# EAGLE design standalone (EAGLE 6.3)
AUTHOR: Ashley Grealish; VERSION: 0.1
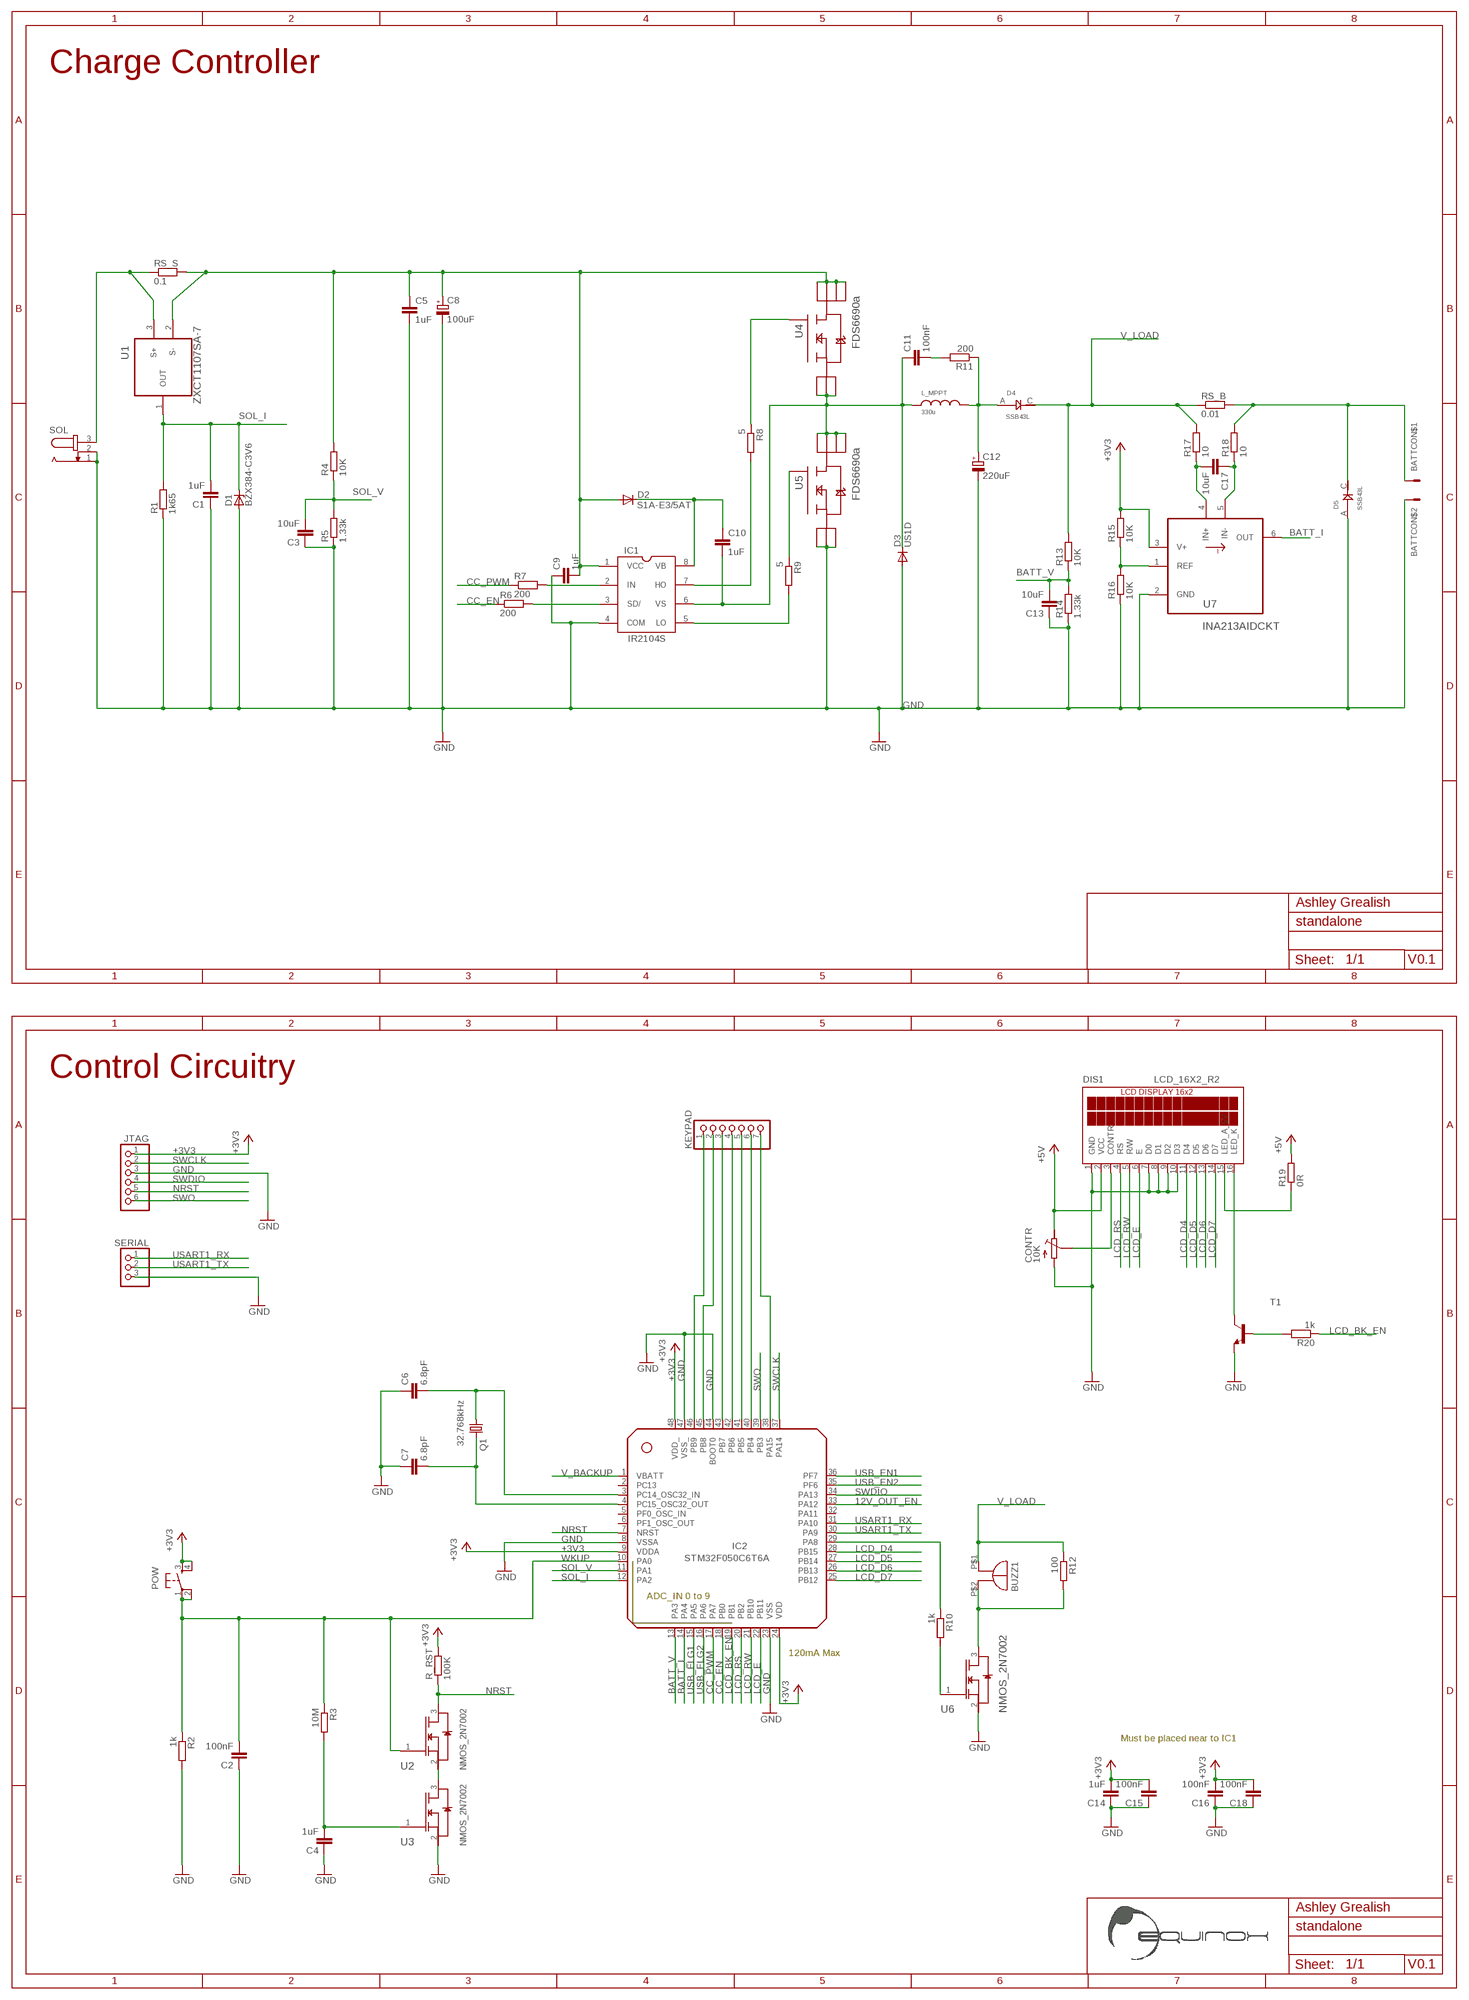
[diagram p0: schematic, sheet 1, part 1 of 2]
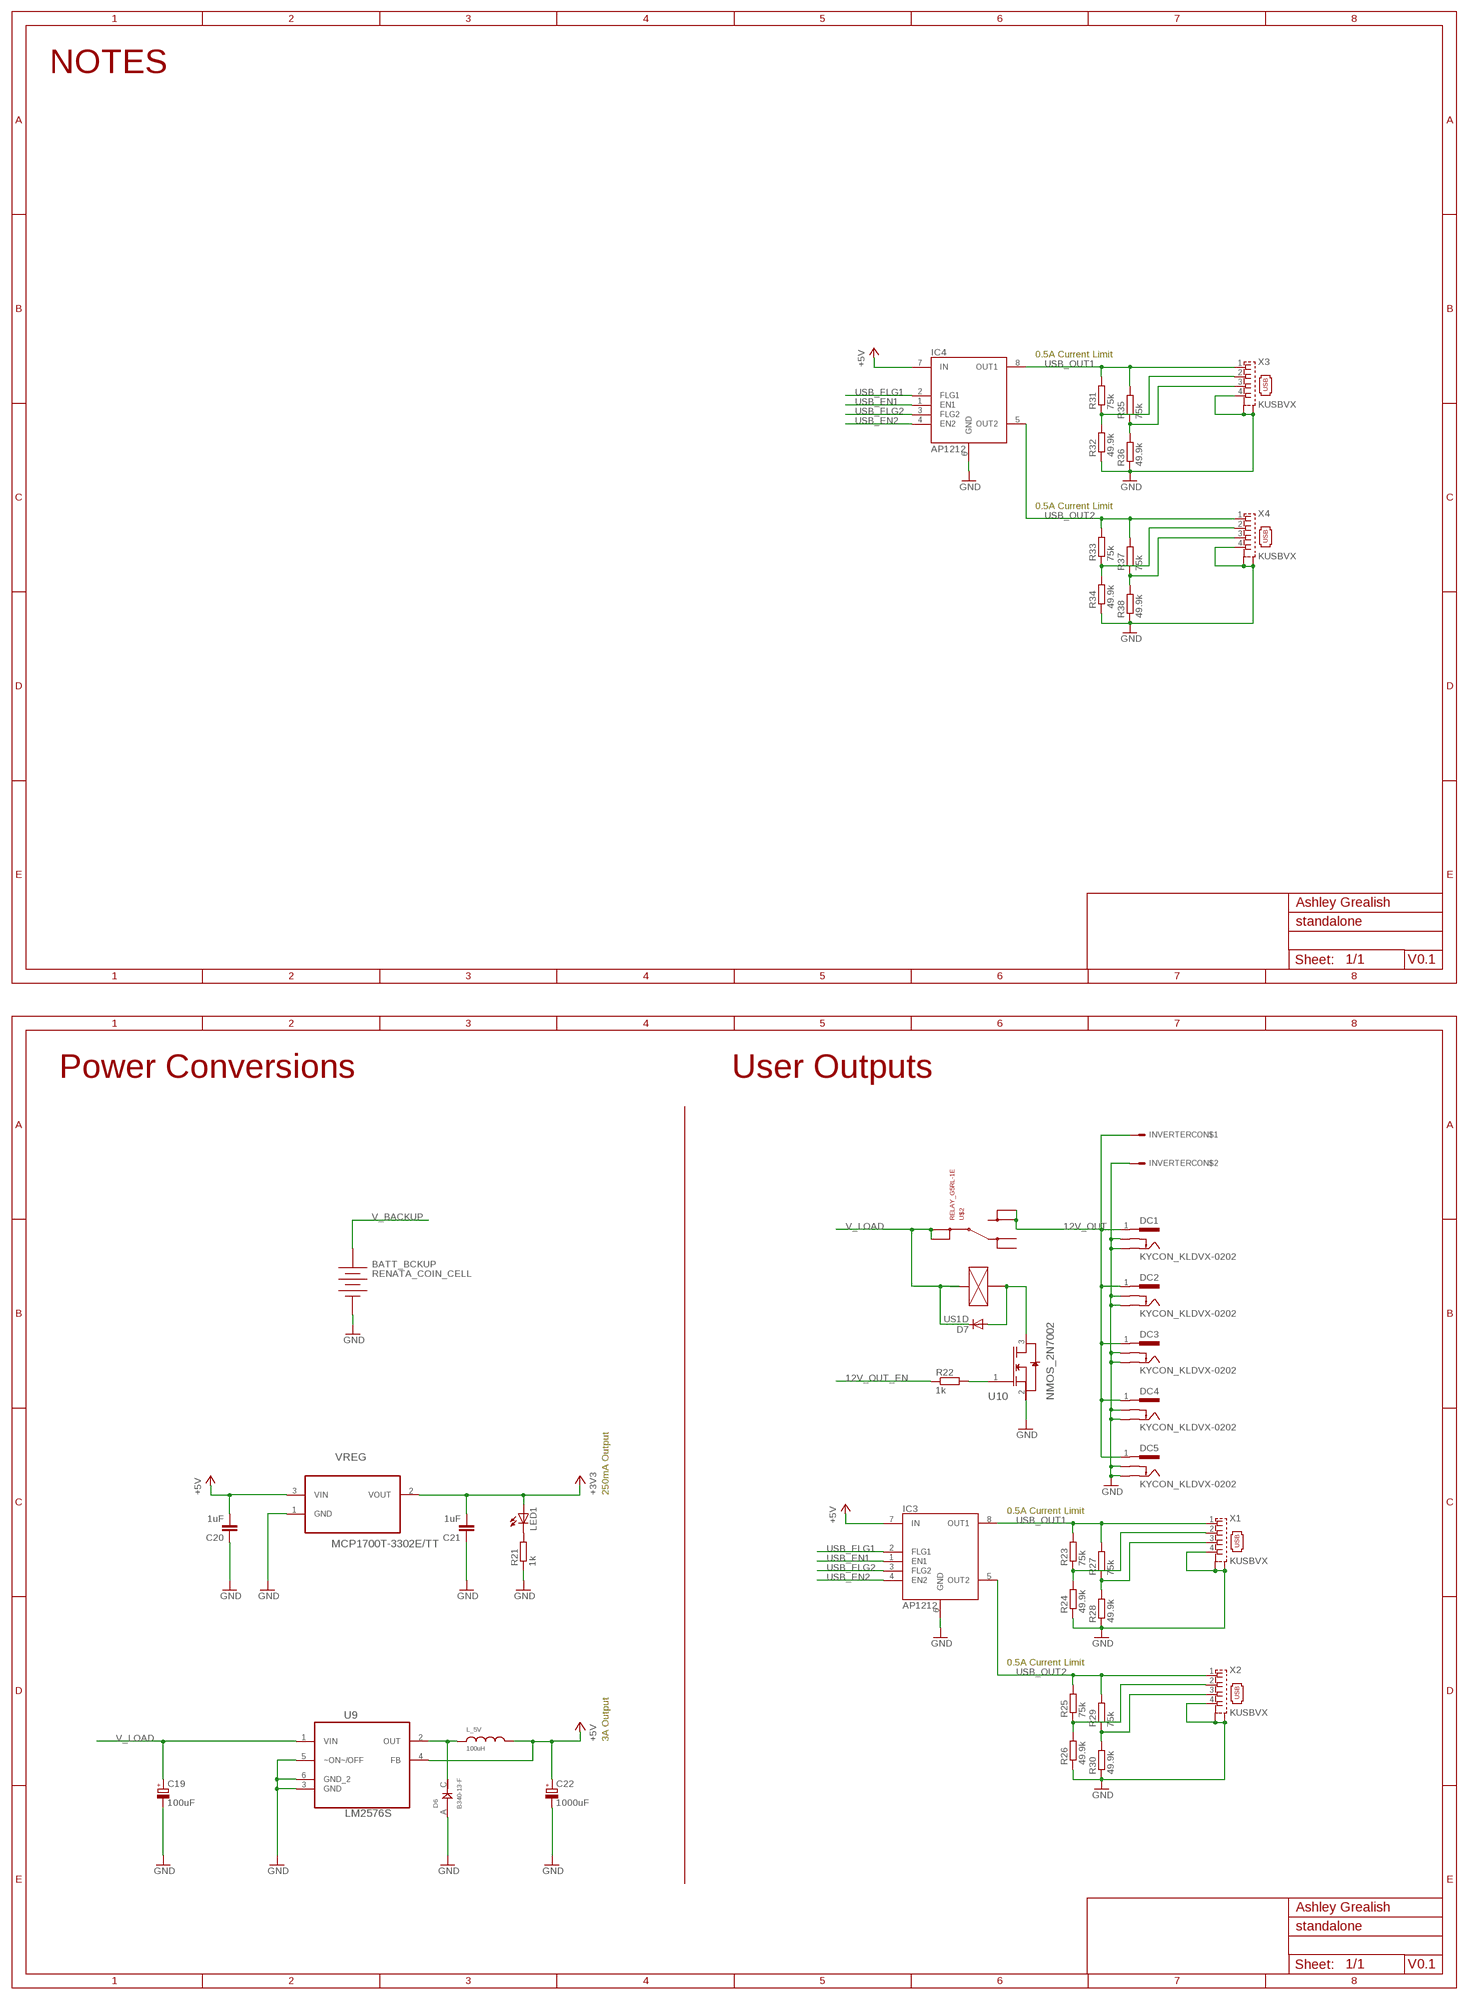
[diagram p1: schematic, sheet 1, part 2 of 2]

## Parts
BATT  CON_MOLEX_39_29_1028  [MOLEX_39_29_1028]
BATT_BCKUP  RENATA_COIN_CELL  PANASONIC_CR2032_1298246  [PANASONIC_CR2032_1298246]
BUZZ1  BUZZ_14MM  [BUZZ_14MM_5M_PINS]
C1  1uF  C-EUC0805K  [C0805K]
C2  100nF  C-EUC0805K  [C0805K]
C3  10uF  C-EUC0805K  [C0805K]
C4  1uF  C-EUC0805K  [C0805K]
C5  1uF  C-EUC0805K  [C0805K]
C6  6.8pF  C-EUC0603K  [C0603K]
C7  6.8pF  C-EUC0603K  [C0603K]
C8  100uF  CPOL-EUE  [PANASONIC_E]
C9  1uF  C-EUC0805K  [C0805K]
C10  1uF  C-EUC0805K  [C0805K]
C11  100nF  C-EUC0805K  [C0805K]
C12  220uF  CPOL-EUF  [PANASONIC_F]
C13  10uF  C-EUC0805K  [C0805K]
C14  1uF  C-EUC0805K  [C0805K]
C15  100nF  C-EUC0805K  [C0805K]
C16  100nF  C-EUC0805K  [C0805K]
C17  10uF  C-EUC0805K  [C0805K]
C18  100nF  C-EUC0805K  [C0805K]
C19  100uF  CPOL-EUE  [PANASONIC_E]
C20  1uF  C-EUC0805K  [C0805K]
C21  1uF  C-EUC0805K  [C0805K]
C22  1000uF  CPOL-EUG  [PANASONIC_G]
CONTR  10K  R_TRIMM_TC33X  [R_TRIMM_RC33X]
D1  BZX384-C3V6  [SOD323]
D2  S1A-E3/5AT  DIODE-DO-214AC  [DO-214AC]
D3  US1D  DIODE-DO-214AC  [DO-214AC]
D4  SSB43L  DIODE_SSB43L  [DO214AA]
D5  SSB43L  DIODE_SSB43L  [DO214AA]
D6  B340-13-F  DIODE_B340-13-F  [SMC]
D7  US1D  DIODE-DO-214AC  [DO-214AC]
DC1  KYCON_KLDVX-0202  [KYCON_KLVDX_2020_B]
DC2  KYCON_KLDVX-0202  [KYCON_KLVDX_2020_B]
DC3  KYCON_KLDVX-0202  [KYCON_KLVDX_2020_B]
DC4  KYCON_KLDVX-0202  [KYCON_KLVDX_2020_B]
DC5  KYCON_KLDVX-0202  [KYCON_KLVDX_2020_B]
DIS1  LCD_16X2_R2  [LCD_16X2_R2]
IC1  IR2104S  [IR2104S]
IC2  STM32F050C6T6A  [LQFP48]
IC3  AP1212  [SO8]
IC4  AP1212  [SO8]
INVERTER  CON_MOLEX_39_29_1028  [MOLEX_39_29_1028]
JTAG  PINHD-1X6  [1X06]
KEYPAD  PINHD-1X7/90  [1X07/90]
L_5V  100uH  INDUC_BOURNES_SDR2207  [INDUC_BOURNS_SDR2207]
L_MPPT  330u  INDUC_MURATA_1433428C  [INDUC_MURATA_1433428C]
LED1  POW_3V3  LEDCHIPLED_0805  [CHIPLED_0805]
POW  TAC_SWITCHPTH  [TACTILE-PTH]
Q1  32.768kHz  MC-306  [MC-306]
R1  1k65  R-EU_M0805  [M0805]
R2  1k  R-EU_M0805  [M0805]
R3  10M  R-EU_M0805  [M0805]
R4  10K  R-EU_M0805  [M0805]
R5  1.33k  R-EU_M0805  [M0805]
R6  200  R-EU_M0805  [M0805]
R7  200  R-EU_M0805  [M0805]
R8  5  R-EU_M0805  [M0805]
R9  5  R-EU_M0805  [M0805]
R10  1k  R-EU_M0805  [M0805]
R11  200  R-EU_M0805  [M0805]
R12  100  R-EU_M0805  [M0805]
R13  10K  R-EU_M0805  [M0805]
R14  1.33k  R-EU_M0805  [M0805]
R15  10K  R-EU_M0805  [M0805]
R16  10K  R-EU_M0805  [M0805]
R17  10  R-EU_M0805  [M0805]
R18  10  R-EU_M0805  [M0805]
R19  0R  R-EU_M0805  [M0805]
R20  1k  R-EU_M0805  [M0805]
R21  1k  R-EU_M0805  [M0805]
R22  1k  R-EU_M0805  [M0805]
R23  75k  R-EU_M0805  [M0805]
R24  49.9k  R-EU_M0805  [M0805]
R25  75k  R-EU_M0805  [M0805]
R26  49.9k  R-EU_M0805  [M0805]
R27  75k  R-EU_M0805  [M0805]
R28  49.9k  R-EU_M0805  [M0805]
R29  75k  R-EU_M0805  [M0805]
R30  49.9k  R-EU_M0805  [M0805]
R31  75k  R-EU_M0805  [M0805]
R32  49.9k  R-EU_M0805  [M0805]
R33  75k  R-EU_M0805  [M0805]
R34  49.9k  R-EU_M0805  [M0805]
R35  75k  R-EU_M0805  [M0805]
R36  49.9k  R-EU_M0805  [M0805]
R37  75k  R-EU_M0805  [M0805]
R38  49.9k  R-EU_M0805  [M0805]
R_RST  100K  R-EU_M0805  [M0805]
RS_B  0.01  R-EU_R2512  [R2512]
RS_S  0.1  R-EU_R2512  [R2512]
SERIAL  PINHD-1X3  [1X03]
SOL  JACK-PLUG0  [SPC4077]
T1  BC847B-NPN-SOT23-BEC  [SOT23-BEC]
U1  ZXCT1107SA-7  [SOT91P240X110-3N]
U2  NMOS_2N7002  [SOT103P240X110-3N]
U3  NMOS_2N7002  [SOT103P240X110-3N]
U4  FDS6690a  DMS3016SSS-13  [SOIC127P600X175-8N]
U5  FDS6690a  DMS3016SSS-13  [SOIC127P600X175-8N]
U6  NMOS_2N7002  [SOT103P240X110-3N]
U7  INA213AIDCKT  [SOT65P210X110-6N]
U9  LM2576S  [TO263-5]
U10  NMOS_2N7002  [SOT103P240X110-3N]
U$1  EQUINOX_LOGO_LARGE  [EQUINOX_LOGO_LARGE]
U$2  RELAY_G5RL-1E  [G5RL-1E]
VREG  MCP1700T-3302E/TT  [SOT95P237X112-3N]
X1  KUSBVX  [KUSBVX]
X2  KUSBVX  [KUSBVX]
X3  KUSBVX  [KUSBVX]
X4  KUSBVX  [KUSBVX]

## Nets
12V_OUT [pow_12v]: DC1.1(PAD1) DC2.1(PAD1) DC3.1(PAD1) DC4.1(PAD1) DC5.1(PAD1) INVERTER.P$1 U$2.NO@1(NO) U$2.NO@2(NO)
12V_OUT_EN: IC2.33(PA12) R22.1
+3V3: C14.2 C15.2 C16.2 C18.2 C21.2 IC2.9(VDDA) IC2.24(VDD) IC2.48(VDD_) JTAG.1 LED1.A POW.3 POW.4 R15.2 R_RST.2 U7.3(V+) VREG.2(VOUT)
+5V: C20.2 C22.+ CONTR.CW(A) DIS1.2(VCC) IC3.7(IN) IC4.7(IN) L_5V.P$2 R19.2 U9.4(FB) VREG.3(VIN)
BATT_I: IC2.14(PA4) U7.6(OUT)
BATT_V: C13.2 IC2.13(PA3) R13.1 R14.2
CC_EN: IC2.18(PB0) R6.1
CC_PWM: IC2.17(PA7) R7.1
GND [gnd]: BATT.P$2 BATT_BCKUP.P-(NEG) C1.1 C2.1 C3.1 C4.1 C5.2 C6.1 C7.1 C8.- C9.1 C12.- C13.1 C14.1 C15.1 C16.1 C18.1 C19.- C20.1 C21.1 C22.- CONTR.CCW(E) D1.A D3.A D5.A(ANODE) D6.A(ANODE) DC1.2(PAD2) DC1.3(PAD3) DC2.2(PAD2) DC2.3(PAD3) DC3.2(PAD2) DC3.3(PAD3) DC4.2(PAD2) DC4.3(PAD3) DC5.2(PAD2) DC5.3(PAD3) DIS1.1(GND) DIS1.7(D0) DIS1.8(D1) DIS1.9(D2) DIS1.10(D3) IC1.4(COM) IC2.8(VSSA) IC2.23(VSS) IC2.44(BOOT0) IC2.47(VSS_) IC3.6(GND) IC4.6(GND) INVERTER.P$2 JTAG.3 R1.1 R2.2 R5.1 R14.1 R16.1 R21.1 R24.1 R26.1 R28.1 R30.1 R32.1 R34.1 R36.1 R38.1 SERIAL.3 SOL.1 SOL.2 T1.E U3.2(S) U5.1(S_2) U5.2(S_3) U5.3(S) U6.2(S) U7.2(GND) U9.3(GND) U9.5(~ON~/OFF) U9.6(GND_2) U10.2(S) VREG.1(GND) X1.4 X1.M1(S1) X1.M2(S2) X2.4 X2.M1(S1) X2.M2(S2) X3.4 X3.M1(S1) X3.M2(S2) X4.4 X4.M1(S1) X4.M2(S2)
LCD_BK_EN: IC2.19(PB1) R20.1
LCD_D4: DIS1.11(D4) IC2.28(PB15)
LCD_D5: DIS1.12(D5) IC2.27(PB14)
LCD_D6: DIS1.13(D6) IC2.26(PB13)
LCD_D7: DIS1.14(D7) IC2.25(PB12)
LCD_E: DIS1.6(E) IC2.22(PB11)
LCD_RS: DIS1.4(RS) IC2.20(PB2)
LCD_RW: DIS1.5(R/W) IC2.21(PB10)
N$1: C6.2 IC2.3(PC14_OSC32_IN) Q1.1
N$2: CONTR.WIPE(S) DIS1.3(CONTR)
N$3: IC1.3(SD/) R6.2
N$4 [pwr]: BATT.P$1 D5.C(CATHODE) R18.2 RS_B.2
N$5: R31.1 R32.2 X3.2
N$6 [pwr]: C10.2 C11.1 D3.C IC1.6(VS) L_MPPT.P$1 U4.1(S_2) U4.2(S_3) U4.3(S) U5.5(D_3) U5.6(D_2) U5.7(D_4) U5.8(D)
N$7: IC1.7(HO) R8.2
N$8: IC1.2(IN) R7.2
N$10: C10.1 D2.C IC1.8(VB)
N$11: R9.1 U5.4(G)
N$12: C12.+ D4.A(ANODE) L_MPPT.P$2 R11.1
N$13: IC1.5(LO) R9.2
N$14: R8.1 U4.4(G)
N$15: C11.2 R11.2
N$16 [pwr]: C5.1 C8.+ C9.2 D2.A IC1.1(VCC) R4.2 RS_S.2 U1.2(S-) U4.5(D_3) U4.6(D_2) U4.7(D_4) U4.8(D)
N$17: R35.1 R36.2 X3.3
N$19: DIS1.15(LED_A_5V) R19.1
N$20: R25.1 R26.2 X2.2
N$21: D6.C(CATHODE) L_5V.P$1 U9.2(OUT)
N$22: IC2.29(PA8) R10.1
N$23: IC2.46(PB9) KEYPAD.1
N$24: IC2.45(PB8) KEYPAD.2
N$26: IC2.43(PB7) KEYPAD.3
N$27: IC2.42(PB6) KEYPAD.4
N$28: IC2.41(PB5) KEYPAD.5
N$29: IC2.40(PB4) KEYPAD.6
N$30: IC2.38(PA15) KEYPAD.7
N$31: DIS1.16(LED_K) T1.C
N$32: R20.2 T1.B
N$33: R23.1 R24.2 X1.2
N$34: R27.1 R28.2 X1.3
N$35: R22.2 U10.1(G)
N$36: R29.1 R30.2 X2.3
N$37: LED1.C R21.2
N$38 [pwr]: RS_S.1 SOL.3 U1.3(S+)
N$39: R15.1 R16.2 U7.1(REF)
N$40: C17.2 R17.1 U7.4(IN+)
N$41: C17.1 R18.1 U7.5(IN-)
N$42: BUZZ1.P$2(-) R12.2 U6.3(D)
N$43: R10.2 U6.1(G)
N$44: C4.2 R3.2 U3.1(G)
N$45: U2.2(S) U3.3(D)
N$47: R33.1 R34.2 X4.2
N$48: R37.1 R38.2 X4.3
N$49: C7.2 IC2.4(PC15_OSC32_OUT) Q1.4
N$50: D7.A U10.3(D) U$2.COIL+
NRST: IC2.7(NRST) JTAG.5 R_RST.1 U2.3(D)
SOL_I: C1.2 D1.C IC2.12(PA2) R1.2 U1.1(OUT)
SOL_V: C3.2 IC2.11(PA1) R4.1 R5.2
SWCLK: IC2.37(PA14) JTAG.2
SWDIO: IC2.34(PA13) JTAG.4
SWO: IC2.39(PB3) JTAG.6
USART1_RX: IC2.31(PA10) SERIAL.1
USART1_TX: IC2.30(PA9) SERIAL.2
USB_EN1: IC2.36(PF7) IC3.1(EN1) IC4.1(EN1)
USB_EN2: IC2.35(PF6) IC3.4(EN2) IC4.4(EN2)
USB_FLG1: IC2.15(PA5) IC3.2(FLG1) IC4.2(FLG1)
USB_FLG2: IC2.16(PA6) IC3.3(FLG2) IC4.3(FLG2)
USB_OUT1 [pwr]: IC3.8(OUT1) IC4.8(OUT1) R23.2 R27.2 R31.2 R35.2 X1.1 X3.1
USB_OUT2 [pwr]: IC3.5(OUT2) IC4.5(OUT2) R25.2 R29.2 R33.2 R37.2 X2.1 X4.1
V_BACKUP: BATT_BCKUP.P+(POS) IC2.1(VBATT)
V_LOAD: BUZZ1.P$1(+) C19.+ D4.C(CATHODE) D7.C R12.1 R13.2 R17.2 RS_B.1 U9.1(VIN) U$2.COM@1(COM) U$2.COM@2(COM)
WKUP: C2.2 IC2.10(PA0) POW.1 POW.2 R2.1 R3.1 U2.1(G)
Unconnected: IC2.2(PC13) IC2.5(PF0_OSC_IN) IC2.6(PF1_OSC_OUT) IC2.32(PA11) U$2.COIL- U$2.NC@1(NC) U$2.NC@2(NC)

## Notes on the sheet
- Charge Controller | NOTES
- 0.5A Current Limit
- 0.5A Current Limit
- V | V
- Control Circuitry | Power Conversions | User Outputs
- 250mA Output
- 0.5A Current Limit
- ADC_IN 0 to 9
- 120mA Max
- 0.5A Current Limit
- Must be placed near to IC1 | 3A Output
- V | V

## Library data of the parts
BATT = equinox:CON_MOLEX_39_29_1028; OC_FARNELL: 1012166
BATT_BCKUP = coin_cells:PANASONIC_CR2032_1298246: Farnell Part No: 1298246; OC_FARNELL: 1298246
BUZZ1 = equinox:BUZZ_14MM; OC_FARNELL: 1192513
C1-C5 C9-C11 C13-C18 C20 C21 = resistor:C-EU: CAPACITOR, European symbol
C6 C7 = resistor:C-EU: CAPACITOR, European symbol; OC_FARNELL: 1856141
C8 C19 = resistor:CPOL-EU: POLARIZED CAPACITOR, European symbol; OC_FARNELL: 1539489
C12 = resistor:CPOL-EU: POLARIZED CAPACITOR, European symbol; OC_FARNELL: 9695877
C22 = resistor:CPOL-EU: POLARIZED CAPACITOR, European symbol; OC_FARNELL: 1244342
CONTR = equinox:R_TRIMM_TC33X; OC_FARNELL: 1689863; OC_MOUSER: 652-TC33X-2-103E
D1 = equinox:BZX384-C3V6; OC_FARNELL: 8735654
D2 = diode:DIODE-: DIODE; OC_FARNELL: 9550216
D3 D7 = diode:DIODE-: DIODE; OC_FARNELL: 1625280
D4 D5 = equinox:DIODE_SSB43L: VISHAY - SSB43L-E3/52T - DIODE, SCHOTTKY, 4A, 30V Farnell: 1336556; OC_FARNELL: 1336556
D6 = equinox:DIODE_B340-13-F; OC_FARNELL: 1843695
DC1-DC5 = equinox:KYCON_KLDVX-0202; TOBY: DC-031-B
DIS1 = equinox:LCD_16X2_R2: Supplier: info <info@huaxinjin.com> Model: 1602C-1; OC_FARNELL: unknown; OC_NEWARK: unknown
IC1 = equinox:IR2104S: Half Bridge Mosfet - IGBT driver SOIC; OC_FARNELL: 8638756
IC2 = equinox:STM32F050C6T6A; OC_FARNELL: 2115059
IC3 IC4 = equinox:AP1212: Datasheet: http://www.farnell.com/datasheets/608767.pdf Can be replaced with newer AP2156SG-13 RS:http://uk.rs-online.com/web/p/products/7512963P/?cm_mmc=aff-_-uk-_-octopart-_-7512963P; OC_FARNELL: 1825302
INVERTER = equinox:CON_MOLEX_39_29_1028
JTAG = pinhead:PINHD-1X6: PIN HEADER
KEYPAD = pinhead:PINHD-1X7: PIN HEADER; OC_FARNELL: 588763
L_5V = equinox:INDUC_BOURNES_SDR2207; FARNELL: 1612709; OC_FARNELL: 1612709
L_MPPT = equinox:INDUC_MURATA_1433428C; OC_FARNELL: 1077018
LED1 = led:LED: LED OSRAM: - CHIPLED LG R971, LG N971, LY N971, LG Q971, LY Q971, LO R971, LY R971 LH N974, LH R974 LS Q976, LO Q976, LY Q976 LO Q996 - Hyper CHIPLED LW Q18S LB Q993, LB Q99A, LB R99A - SideLED LS A670, LO A670, LY A670, LG A670, LP A670 LB A673, LV A673, LT A673, LW A673 LH A674 LY A675 LS A676, LA A676, LO A676, LY A676, LW A676 LS A679, LY A679, LG A679 - Hyper Micro SIDELED® LS Y876, LA Y876, LO Y876, LY Y876 LT Y87S - SmartLED LW L88C, LW L88S LB L89C, LB L89S, LG L890 LS L89K, LO L89K, LY L89K LS L896, LA L896, LO L896, LY L896 - TOPLED LS T670, LO T670, LY T670, LG T670, LP T670 LSG T670, LSP T670, LSY T670, LOP T670, LYG T670 LG T671, LOG T671, LSG T671 LB T673, LV T673, LT T673, LW T673 LH T674 LS T676, LA T676, LO T676, LY T676, LB T676, LH T676, LSB T676, LW T676 LB T67C, LV T67C, LT T67C, LS T67K, LO T67K, LY T67K, LW E67C LS E67B, LA E67B, LO E67B, LY E67B, LB E67C, LV E67C, LT E67C LW T67C LS T679, LY T679, LG T679 LS T770, LO T770, LY T770, LG T770, LP T770 LB T773, LV T773, LT T773, LW T773 LH T774 LS E675, LA E675, LY E675, LS T675 LS T776, LA T776, LO T776, LY T776, LB T776 LHGB T686 LT T68C, LB T68C - Hyper Mini TOPLED® LB M676 - Mini TOPLED Santana® LG M470 LS M47K, LO M47K, LY M47K Source: http://www.osram.convergy.de LUXEON: - LUMILED® LXK2-PW12-R00, LXK2-PW12-S00, LXK2-PW14-U00, LXK2-PW14-V00 LXK2-PM12-R00, LXK2-PM12-S00, LXK2-PM14-U00 LXK2-PE12-Q00, LXK2-PE12-R00, LXK2-PE12-S00, LXK2-PE14-T00, LXK2-PE14-U00 LXK2-PB12-K00, LXK2-PB12-L00, LXK2-PB12-M00, LXK2-PB14-N00, LXK2-PB14-P00, LXK2-PB14-Q00 LXK2-PR12-L00, LXK2-PR12-M00, LXK2-PR14-Q00, LXK2-PR14-R00 LXK2-PD12-Q00, LXK2-PD12-R00, LXK2-PD12-S00 LXK2-PH12-R00, LXK2-PH12-S00 LXK2-PL12-P00, LXK2-PL12-Q00, LXK2-PL12-R00 Source: www.luxeon.com KINGBRIGHT: KA-3528ASYC Source: www.kingbright.com
POW = equinox:TAC_SWITCH: Momentary Switch Button commonly used for reset or general input. Spark Fun Electronics SKU : COM-00097; RS: 758-1979
Q1 = crystal:MC-306: kHz RANGE CRYSTAL UNIT SMD Source: MC-306_405_406_E07X.PDF Homepage <http://www.epsontoyocom.co.jp>; MPN: MC-306; OC_FARNELL: 1712823; OC_NEWARK: -
R1 R4-R9 R11 R13-R18 R22 R_RST RS_B RS_S = rcl:R-EU_: RESISTOR, European symbol
R2 R3 R10 R12 R19-R21 R23-R38 = resistor:R-EU_: RESISTOR, European symbol
SERIAL = pinhead:PINHD-1X3: PIN HEADER
SOL = con-jack:JACK-PLUG: DC POWER JACK Power Jack, DC, Right Angle, Through Hole, Rated 5A at 16VDC, PC Terminals Distributor: Farnell (www.Farnell.de) Drawing: 84N1161.pdf / 84N1162.pdf Manufacturer: SPC Technology (www.spctechnology.com) Type: SPC4077 / SPC 4078; OC_FARNELL: unknown; OC_NEWARK: unknown; TOBY: DC-001-A-2.1mm-R
T1 = transistor:*-NPN-: NPN Transistror BF959 corrected 2008.03.06
U1 = equinox:ZXCT1107SA-7: LOW POWER HIGH-SIDE CURRENT MONITORS; MPN: ZXCT1107SA-7; OC_FARNELL: 1904027; OC_NEWARK: 55T4047; PACKAGE: SOT-23-3; SUPPLIER: DIODES INC.
U2 U3 U6 U10 = equinox:NMOS_2N7002: N-CHANNEL ENHANCEMENT MODE FIELD EFFECT TRANSISTOR; MPN: 2N7002-7-F; OC_FARNELL: 1713823; OC_NEWARK: 25R5679; PACKAGE: SOT-23-3; SUPPLIER: DIODES INC.
U4 U5 = equinox:DMS3016SSS-13: ENHANCEMENT MODE MOSFET; OC_FARNELL: 9845275; PACKAGE: SOIC-8
U7 = equinox:INA213AIDCKT: CURRENT SHUNT MONITOR; MPN: INA213AIDCKT; OC_FARNELL: 1754261; OC_NEWARK: 05N1040; PACKAGE: SC-70-6; SUPPLIER: Texas Instruments
U9 = equinox:LM2576S; OC_FARNELL: 1469178
U$1 = equinox:EQUINOX_LOGO_LARGE
U$2 = equinox:RELAY_G5RL-1E
VREG = equinox:MCP1700T-3302E/TT: Low Quiescent Current LDO; MPN: MCP1700T-3302E/TT; OC_FARNELL: 1296592; OC_NEWARK: 88H9817; PACKAGE: SOT23-3; SUPPLIER: Microchip
X1-X4 = con-kycon:KUSBVX: Vertical,Top Entry Universal Serial Bus Connector KUSBVX Series Source: KYCON Sibalco USB vertical socket KUSBV.pdf

## Net classes
0 default: width 0.381 mm, drill 0.61 mm, clearance 0.381 mm
1 pwr: width 0.026 mm, drill 0.61 mm, clearance 0.508 mm
2 pow_12v: width 1.372 mm, drill 0.762 mm, clearance 0.508 mm
3 gnd: width 0.508 mm, drill 0.61 mm

## Board
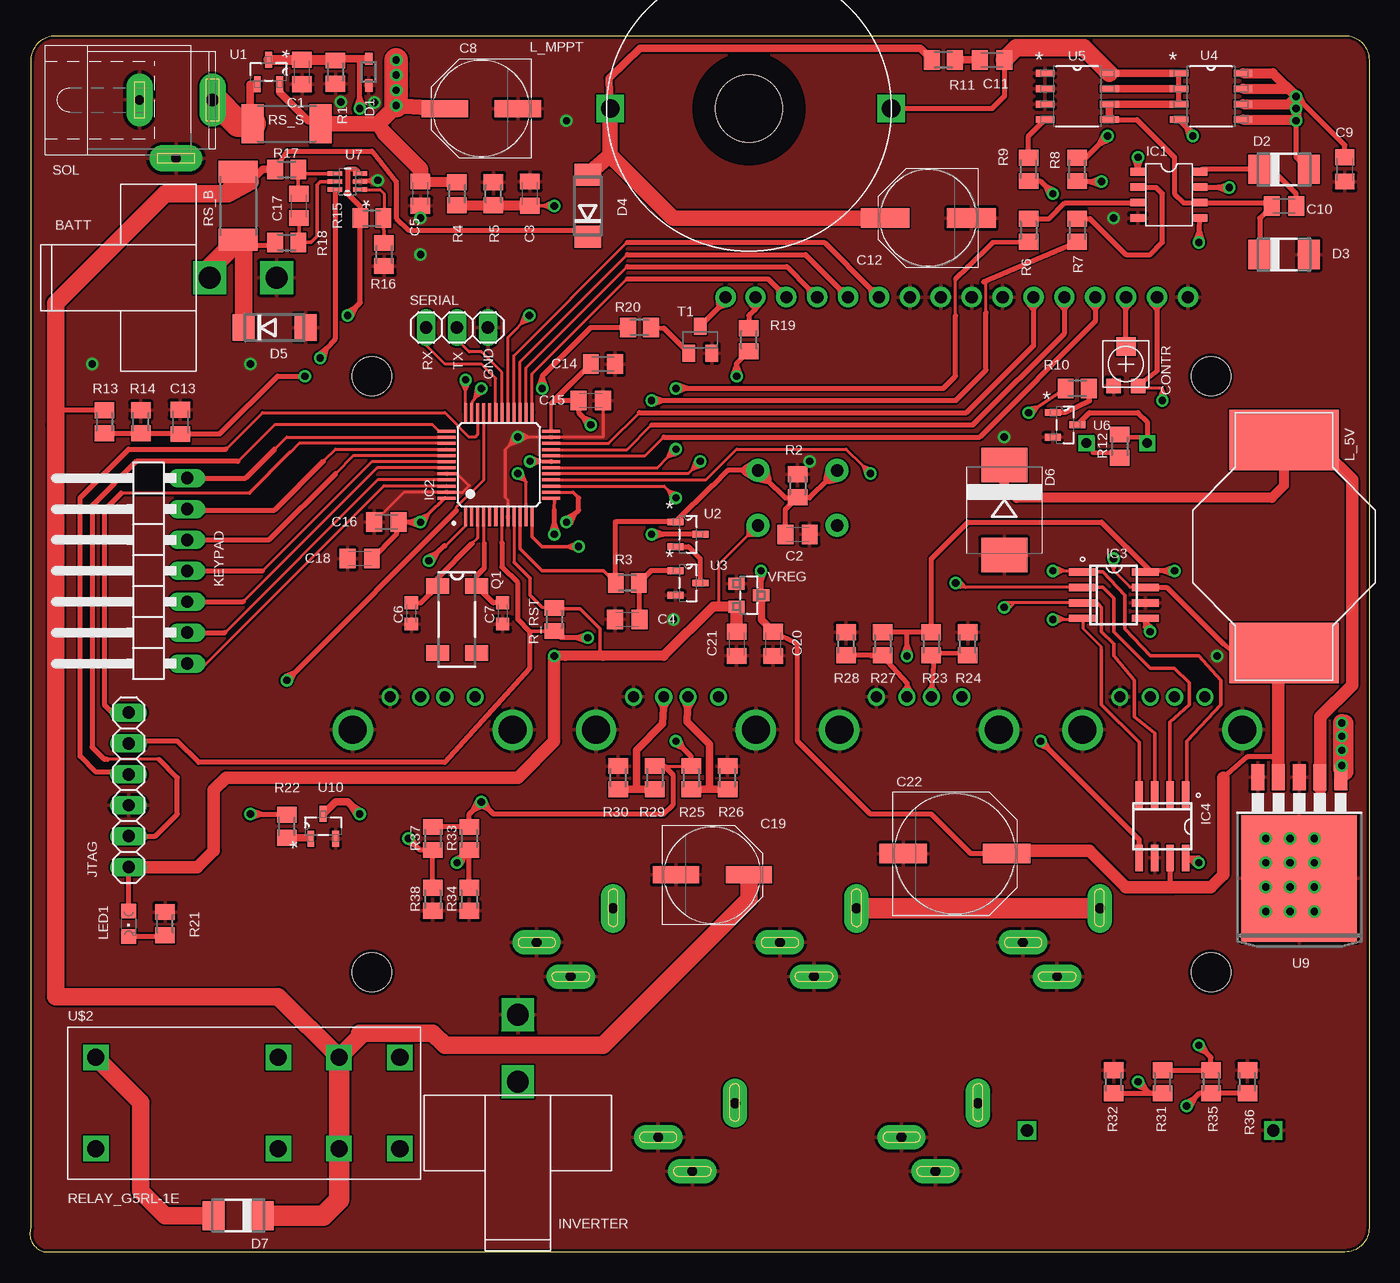
[diagram p2: board, top side]
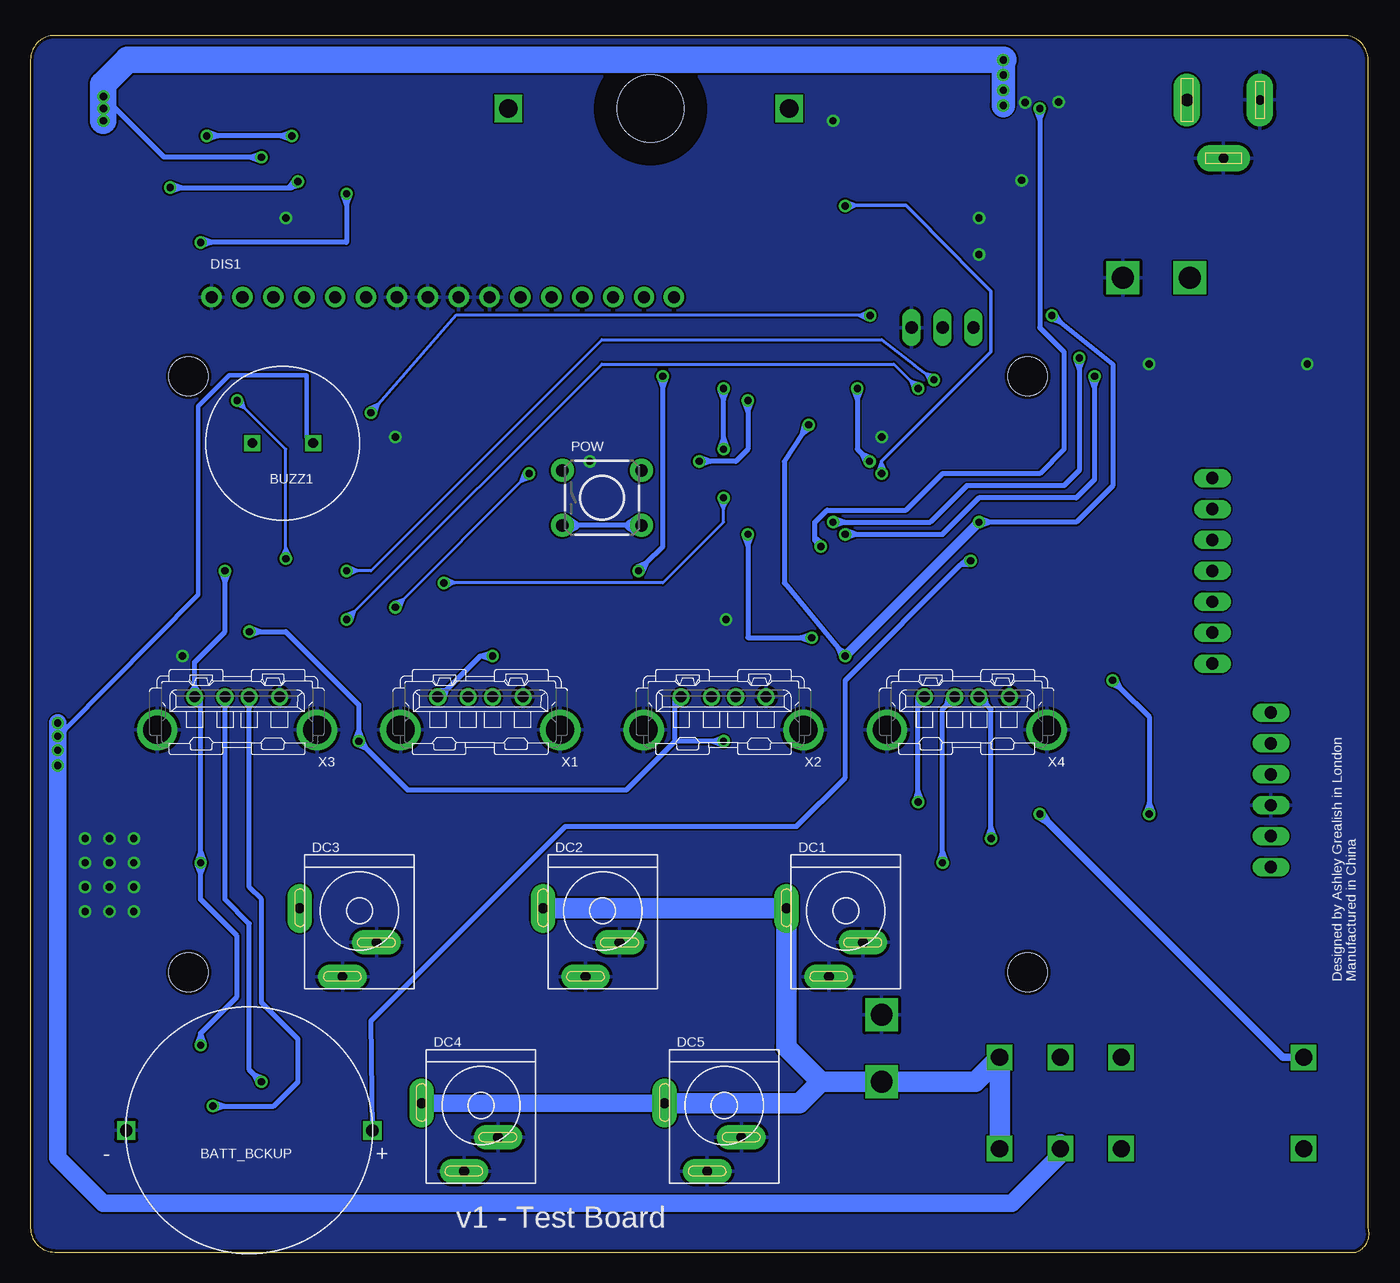
[diagram p3: board, bottom side, seen from below]

Size 110.08 x 100 mm. Coordinates in mm from the lower left corner, seen from the top.
Outline: 110.08,98 110.08,2 arc-90 108.08,0 1.08,0 arc-90 0.08,2 0.08,98 arc-90 2.08,100 108.08,100 arc-90 110.08,98
Copper layers (1*16): Top 0.035mm / dielectric 1.5mm / Bottom 0.035mm
Design rules "Fusion_eagle_rule_v1.1": minimum track width 6mil, minimum drill 12mil, track to track 6mil, track to pad 6mil, pad to pad 6mil, via to via 6mil, smd to smd 0mil, copper to edge 10mil, drill to drill 10mil, minimum pad ring 10mil, minimum via ring 6mil, stop-mask expansion 2mil, vias tented up to drill 100mil, thermal gap 10mil
Holes 3.2 mm at 28.08,72 28.08,23 97.08,23 97.08,72

### Footprints (pad centres in the part's own frame; a part is rotated, then mirrored left to right if it is on the bottom)
MOLEX_39_29_1028 = drill 1.8 square: P$1 0,0; P$2 0,5.5
PANASONIC_CR2032_1298246 = drill 1 square: P+ -10.125,0; P- 10.125,0
BUZZ_14MM_5M_PINS = drill 0.8 square: P$1 -2.5,0; P$2 2.5,0
C0805K = smd 1.3 x 1.6: 1 -1,0; 2 1,0
C0603K = smd 1.05 x 1.08: 1 -0.875,0; 2 0.875,0
PANASONIC_E = smd 3.8 x 1.4: + 3,0; - -3,0
PANASONIC_F = smd 4 x 1.6: + 3.55,0; - -3.55,0
PANASONIC_G = smd 3.9 x 1.6: + 4.25,0; - -4.25,0
R_TRIMM_RC33X = smd 1.194 x 1.194: CCW -1,-1.8; CW 1,-1.8 | smd 1.6 x 1.5: WIPE 0,1.45
SOD323 = smd 1 x 0.6: A 1.1,0; C -1.1,0
DO-214AC = smd 1.8 x 2.4: A 2.025,0; C -2.025,0
DO214AA = smd 1.8 x 2.2: A 2.55,0; C -2.55,0
SMC = smd 2.8 x 3.8: A 3.7,0; C -3.7,0
KYCON_KLVDX_2020_B = drill 0.813 pad 2 long: 1 -4.845,0.25; 2 -1.345,-5.35; 3 1.455,-2.55
LCD_16X2_R2 = drill 1 pad 1.676: 1 8,2.5; 2 10.54,2.5; 3 13.08,2.5; 4 15.62,2.5; 5 18.16,2.5; 6 20.7,2.5; 7 23.24,2.5; 8 25.78,2.5; 9 28.32,2.5; 10 30.86,2.5; 11 33.4,2.5; 12 35.94,2.5; 13 38.48,2.5; 14 41.02,2.5; 15 43.56,2.5; 16 46.01,2.5
IR2104S = smd 1.27 x 0.635: 1 0,3.81; 2 0,2.54; 3 0,1.27; 4 0,0; 5 5.08,0; 6 5.08,1.27; 7 5.08,2.54; 8 5.08,3.81
LQFP48 = smd 1.5 x 0.25: 1 -4.3,2.75; 2 -4.3,2.25; 3 -4.3,1.75; 4 -4.3,1.25; 5 -4.3,0.75; 6 -4.3,0.25; 7 -4.3,-0.25; 8 -4.3,-0.75; 9 -4.3,-1.25; 10 -4.3,-1.75; 11 -4.3,-2.25; 12 -4.3,-2.75; 25 4.3,-2.75; 26 4.3,-2.25; 27 4.3,-1.75; 28 4.3,-1.25; 29 4.3,-0.75; 30 4.3,-0.25; 31 4.3,0.25; 32 4.3,0.75; 33 4.3,1.25; 34 4.3,1.75; 35 4.3,2.25; 36 4.3,2.75 | smd 0.25 x 1.5: 13 -2.75,-4.3; 14 -2.25,-4.3; 15 -1.75,-4.3; 16 -1.25,-4.3; 17 -0.75,-4.3; 18 -0.25,-4.3; 19 0.25,-4.3; 20 0.75,-4.3; 21 1.25,-4.3; 22 1.75,-4.3; 23 2.25,-4.3; 24 2.75,-4.3; 37 2.75,4.3; 38 2.25,4.3; 39 1.75,4.3; 40 1.25,4.3; 41 0.75,4.3; 42 0.25,4.3; 43 -0.25,4.3; 44 -0.75,4.3; 45 -1.25,4.3; 46 -1.75,4.3; 47 -2.25,4.3; 48 -2.75,4.3
SO8 = smd 0.6 x 2.2: 1 -1.905,-2.6; 2 -0.635,-2.6; 3 0.635,-2.6; 4 1.905,-2.6; 5 1.905,2.6; 6 0.635,2.6; 7 -0.635,2.6; 8 -1.905,2.6
1X06 = drill 1.016 long: 1 -6.35,0; 2 -3.81,0; 3 -1.27,0; 4 1.27,0; 5 3.81,0; 6 6.35,0
1X07/90 = drill 1.016 long: 1 -7.62,-3.81; 2 -5.08,-3.81; 3 -2.54,-3.81; 4 0,-3.81; 5 2.54,-3.81; 6 5.08,-3.81; 7 7.62,-3.81
INDUC_BOURNS_SDR2207 = smd 5 x 9: P$1 -8.75,0; P$2 8.75,0
INDUC_MURATA_1433428C = drill 1.5 square: P$1 -11.7,0; P$2 11.4,0 | hole 5.5: 0,0
CHIPLED_0805 = smd 1.2 x 1.2: A 0,-1.05; C 0,1.05
TACTILE-PTH = drill 1.016 pad 1.88: 1 -3.251,2.261; 2 3.251,2.261; 3 -3.251,-2.261; 4 3.251,-2.261
MC-306 = smd 1.3 x 1.9: 1 -2.75,-1.6; 2 2.75,-1.6; 3 2.75,1.6; 4 -2.75,1.6
M0805 = smd 1.3 x 1.6: 1 -0.95,0; 2 0.95,0
R2512 = smd 1.8 x 3.2: 1 -2.8,0; 2 2.8,0
1X03 = drill 1.016 long: 1 -2.54,0; 2 0,0; 3 2.54,0
SPC4077 = drill 0.8 pad 2.184 long: 1 -3,0; 2 0,-4.8 | drill 1 pad 2.184 long: 3 3,0
SOT23-BEC = smd 1 x 1.4: B -0.95,-1.1; C 0,1.1; E 0.95,-1.1
SOT91P240X110-3N = smd 1.321 x 0.559: 1 -1.016,0; 2 1.016,0.914; 3 1.016,-0.914
SOT103P240X110-3N = smd 1.321 x 0.559: 1 -1.016,1.016; 2 -1.016,-1.016; 3 1.016,0
SOIC127P600X175-8N = smd 1.524 x 0.559: 1 -2.642,1.905; 2 -2.642,0.635; 3 -2.642,-0.635; 4 -2.642,-1.905; 5 2.642,-1.905; 6 2.642,-0.635; 7 2.642,0.635; 8 2.642,1.905
SOT65P210X110-6N = smd 1.168 x 0.356: 1 -1.041,0.66; 2 -1.041,0; 3 -1.041,-0.66; 4 1.041,-0.66; 5 1.041,0; 6 1.041,0.66
TO263-5 = smd 1.067 x 2.159: 1 -3.404,-5.791; 2 -1.702,-5.791; 3 0,-5.791; 4 1.702,-5.791; 5 3.404,-5.791 | smd 9.5 x 10.41: 6 0,2.54
G5RL-1E = drill 1.4 square: COIL+ -10.7,4; COIL- -10.7,-3.5; COM@1 9.3,4; COM@2 9.3,-3.5; NC@1 4.3,4; NC@2 4.3,-3.5; NO@1 14.3,4; NO@2 14.3,-3.5
SOT95P237X112-3N = smd 0.991 x 1.321: 1 -0.94,-1.016; 2 0.94,-1.016; 3 0,1.016
KUSBVX = drill 0.9 pad 1.3: 1 3.5,0; 2 1,0; 3 -1,0; 4 -3.5,0 | drill 2.3 pad 2.8: M1 -6.57,2.71; M2 6.57,2.71

### Placement (x,y rotation side)
BATT  14.74,80.09 270 top
BATT_BCKUP  92.08,10 180 bottom
BUZZ1  89.33,66.5 180 bottom
C1  22.33,97 90 top
C2  63.08,59 180 top
C3  41.08,87 270 top
C4  49.08,52 0 top
C5  32.08,87 270 top
C6  31.33,52.5 90 top
C7  38.83,52.5 90 top
C8  37.08,94 180 top
C9  108.08,89 90 top
C10  103.08,86 180 top
C11  79.08,98 180 top
C12  73.83,85 180 top
C13  12.33,68.25 270 top
C14  47.08,73 180 top
C15  46.08,70 180 top
C16  29.27,60 0 top
C17  22.08,86 90 top
C18  27.08,57 0 top
C19  56.08,31 0 top
C20  61.08,50 90 top
C21  58.08,50 90 top
C22  76.02,32.75 0 top
CONTR  90.08,73 0 top
D1  27.83,97 270 top
D2  103.08,89 0 top
D3  103.08,82 0 top
D4  45.83,86 90 top
D5  20.08,76 0 top
D6  80.08,61 270 top
D7  17.08,3 180 top
DC1  43.08,28 0 bottom
DC2  63.08,28 0 bottom
DC3  83.08,28 0 bottom
DC4  73.08,12 0 bottom
DC5  53.08,12 0 bottom
DIS1  103.18,76 0 bottom
IC1  91.08,85 0 top
IC2  38.52,64.72 90 top
IC3  89.08,54 270 top
IC4  93.08,35 180 top
INVERTER  40.08,14 0 top
JTAG  8.08,38 90 top
KEYPAD  9.08,56 90 top
L_5V  103.08,58 270 top
L_MPPT  59.08,94 180 top
LED1  8.08,27 180 top
POW  63.08,62 0 bottom
Q1  35.08,52 270 top
R1  25.08,97 90 top
R2  63.08,63 90 top
R3  49.08,55 0 top
R4  35.08,87 90 top
R5  38.08,87 270 top
R6  82.08,84 90 top
R7  86.08,84 90 top
R8  86.08,89 270 top
R9  82.08,89 270 top
R10  86.08,71 0 top
R11  75.08,98 0 top
R12  89.58,66.25 90 top
R13  6.08,68.25 90 top
R14  9.08,68.25 270 top
R15  28.08,85 180 top
R16  29.08,82 90 top
R17  21.08,89 180 top
R18  21.08,83 180 top
R19  59.08,75 270 top
R20  50.08,76 0 top
R21  11.08,27 270 top
R22  21.08,35 270 top
R23  74.08,50 90 top
R24  77.08,50 270 top
R25  54.33,39 90 top
R26  57.33,39 270 top
R27  70.08,50 90 top
R28  67.08,50 270 top
R29  51.33,39 90 top
R30  48.33,39 270 top
R31  93.08,14 90 top
R32  89.08,14 270 top
R33  36.08,34 90 top
R34  36.08,29 90 top
R35  97.08,14 90 top
R36  100.08,14 270 top
R37  33.08,34 90 top
R38  33.08,29 90 top
R_RST  43.08,52 90 top
RS_B  17.08,86 270 top
RS_S  21.08,92.75 0 top
SERIAL  35.08,76 0 top
SOL  11.97,94.7 0 top
T1  55.08,75 0 top
U1  19.58,97 270 top
U2  54.08,59 0 top
U3  54.08,55 0 top
U4  97.08,95 0 top
U5  86.08,95 0 top
U6  85.08,68 0 top
U7  26.08,88 180 top
U9  104.33,33.25 180 top
U10  24.08,35 90 top
U$1  61.79,55.87 0 bottom
U$2  16.08,12 0 top
VREG  59.08,54 270 top
X1  73.08,45.63 180 bottom
X2  53.08,45.63 180 bottom
X3  93.08,45.63 180 bottom
X4  33.08,45.63 180 bottom

### Tracks (layer width: path | path; a pad name or v marks a point on that pad's centre or on a via)
12V_OUT
  Top 1.676: DC3.1 DC2.1
  Bottom 1.422: DC4.1 DC5.1
  Bottom 1.676: DC2.1 DC1.1 47.92,16.84 45.08,14 | 45.08,14 INVERTER.P$1 32.38,14 U$2.NO@1 U$2.NO@2 | DC5.1 46.83,12.25 45.08,14
12V_OUT_EN  (via drill 0.6 pad 1.02)
  Top 0.254: IC2.33 37.27,63.46 35.02,61.21 35.02,60.94
  Top 0.406: 35.02,60.94 21.72,47.64 | 21.72,47.64 v21.08,47 | v18.08,36 18.98,36 | 18.98,36 21.03,36 R22.1 | 21.72,47.64 20.95,47.28 v21.08,47 | 21.72,47.64 21.36,46.87 v21.08,47 | 18.98,36 18.18,36.29 v18.08,36 | 18.98,36 18.18,35.71 v18.08,36
  Bottom 0.406: v21.08,47 20.44,46.36 | 20.44,46.36 18.08,44 18.08,36.9 | 18.08,36.9 v18.08,36 | 20.44,46.36 21.21,46.72 v21.08,47 | 20.44,46.36 20.8,47.13 v21.08,47 | 18.08,36.9 17.79,36.1 v18.08,36 | 18.08,36.9 18.37,36.1 v18.08,36
+3V3  (via drill 0.6 pad 1.02)
  Top 0.254: IC2.48 34.05,61.97 34.08,62 | 42.82,69.74 IC2.24 42.82,69.75 43.07,70 43.08,70 | IC2.9 39.77,56.71 39.78,56.7 | VREG.2 58.14,53.06 | POW.4 59.11,59.02 59.08,58.99 59.07,58.99 56.58,56.5 56.58,53.06
  Top 0.305: 34.08,62 32.72,60.64 | 32.72,60.64 v32.08,60 | 44.08,49 43.98,49 | 47.08,49 46.83,49.25 46.83,51.25 45.18,52.9 43.18,52.9 43.13,52.95 R_RST.2 42.08,53 41.08,54 41.08,55.4 39.78,56.7 | 32.72,60.64 31.95,60.33 v32.08,60 | 32.72,60.64 32.41,59.87 v32.08,60 | 43.98,49 43.22,49.33 v43.08,49 43.22,48.67 43.98,49
  Top 0.406: 43.07,70 C14.2 42.82,69.74 | v32.08,60 31.18,60 | 31.18,60 C16.2 30.08,59 C18.2 | 43.08,70 C15.2 45.08,69 45.44,68.64 | 45.44,68.64 v46.08,68 | LED1.A JTAG.1 | v26.08,77 26.72,77.64 | 26.72,77.64 27.13,78.05 R15.2 27.13,85.95 26.08,87 26.08,89 26.78,89 U7.3 | 31.18,60 31.98,59.71 v32.08,60 | 31.18,60 31.98,60.29 v32.08,60 | 45.44,68.64 45.8,67.87 v46.08,68 | 45.44,68.64 46.21,68.28 v46.08,68 | 26.72,77.64 25.95,77.28 v26.08,77 | 26.72,77.64 26.36,76.87 v26.08,77
  Top 0.508: 59.11,59.02 59.86,59.05 POW.4 59.14,59.77 59.11,59.02
  Top 0.813: VREG.2 56.58,53.06 56.14,53.06 52.08,49 47.08,49 43.98,49 v43.08,49
  Top 1.016: C21.2 58.08,51.08 VREG.2 | JTAG.1 13.73,31.65 15.08,33 15.08,38 16.08,39 40.08,39 43.08,42 v43.08,49
  Bottom 0.406: POW.4 60.84,59.74 65.31,59.74 POW.3 | v46.08,68 46.58,67.25 | 46.58,67.25 48.08,65 48.08,55 43.66,49.69 | v26.08,77 25.38,76.44 | 25.38,76.44 21.08,73 21.08,63 24.08,60 31.18,60 | 31.18,60 v32.08,60 | 43.66,49.69 v43.08,49 | 31.18,60 31.98,59.71 v32.08,60 | 31.18,60 31.98,60.29 v32.08,60 | 43.66,49.69 42.93,49.26 v43.08,49 | 43.66,49.69 43.37,48.9 v43.08,49 | 46.58,67.25 46.38,68.07 v46.08,68 | 46.58,67.25 45.9,67.75 v46.08,68 | 25.38,76.44 26.18,76.71 v26.08,77 | 25.38,76.44 25.82,77.16 v26.08,77
  Bottom 0.813: v32.08,60 v43.08,49 | 60.84,59.74 60.11,60.19 POW.4 60.11,59.28 60.84,59.74 | 65.31,59.74 66.05,59.28 POW.3 66.05,60.19 65.31,59.74
+5V  (via drill 0.6 pad 1.02)
  Top 0.254: IC3.7 90.44,54.63 89.08,56 89.08,56.1 | v93.08,70 93.08,70.9 | 93.08,70.9 93.08,71 91.43,71 CONTR.CW | 89.08,56.1 v89.08,57 | 89.08,56.1 89.42,56.84 v89.08,57 | 89.08,56.1 88.73,56.84 v89.08,57 | 93.08,70.9 92.73,70.16 v93.08,70 | 93.08,70.9 93.42,70.16 v93.08,70
  Top 0.406: DIS1.2 92.64,77.5 | 92.64,77.5 92.64,72.41 CONTR.CW | IC3.7 93.44,54.63 98.08,50 99.33,49 L_5V.P$2 102.63,47.8 | v58.08,72 58.08,72.9 | 58.08,72.9 58.08,73.05 R19.2 | C20.2 63.08,50 63.08,42 69.08,36 74.08,36 77.33,32.75 C22.+ 81.08,33 | U9.4 102.63,40.45 102.08,40.7 100.08,40.7 98.08,39 | IC4.7 93.71,30.36 94.08,30 | v60.08,56 60.08,55.1 | 60.08,55.1 60.08,54.02 VREG.3 | 58.08,72.9 57.79,72.1 v58.08,72 | 58.08,72.9 58.37,72.1 v58.08,72 | 60.08,55.1 60.37,55.9 v60.08,56 | 60.08,55.1 59.79,55.9 v60.08,56 | 92.64,77.5 93.13,78.1 DIS1.2 | 92.64,77.5 92.15,78.1 DIS1.2
  Top 0.61: VREG.3 60.1,51.98 C20.2
  Top 1.016: U9.4 102.63,47.8 | 98.08,39 98.08,31 97.08,30 94.08,30 90.08,30 87.08,33 81.08,33
  Bottom 0.254: v89.08,57 89.08,57.9 | 89.08,57.9 89.08,66 92.44,69.36 | 92.44,69.36 v93.08,70 | 89.08,57.9 88.73,57.16 v89.08,57 | 89.08,57.9 89.42,57.16 v89.08,57 | 92.44,69.36 93.21,69.64 v93.08,70 | 92.44,69.36 92.72,70.13 v93.08,70
  Bottom 0.406: 58.08,71.1 58.08,58 59.44,56.64 | 58.08,71.1 v58.08,72 | 59.44,56.64 v60.08,56 | 58.08,71.1 58.37,71.9 v58.08,72 | 58.08,71.1 57.79,71.9 v58.08,72 | 59.44,56.64 59.8,55.87 v60.08,56 | 59.44,56.64 60.21,56.28 v60.08,56
BATT_I  (via drill 0.6 pad 1.02)
  Top 0.254: IC2.14 44.61,62.47
  Top 0.305: 44.61,62.47 45.08,62
  Top 0.406: v44.08,60 44.72,60.64 | 44.72,60.64 45.08,61 45.08,62 | U7.6 25.04,75.04 24.31,74.26 | 24.31,74.26 23.83,73.75 v23.83,73.5 | 44.72,60.64 43.95,60.28 v44.08,60 | 44.72,60.64 44.36,59.87 v44.08,60 | 24.31,74.26 23.64,73.74 v23.83,73.5 | 24.31,74.26 24.13,73.44 v23.83,73.5
  Bottom 0.406: v44.08,60 43.18,60 | 43.18,60 36.08,60 33.08,63 25.08,63 23.83,64.25 23.83,72.6 | v23.83,73.5 23.83,72.6 | 43.18,60 43.98,59.71 v44.08,60 | 43.18,60 43.98,60.29 v44.08,60 | 23.83,72.6 24.12,73.4 v23.83,73.5 | 23.83,72.6 23.54,73.4 v23.83,73.5
BATT_V  (via drill 0.6 pad 1.02)
  Top 0.305: IC2.13 43.11,61.97 43.08,61
  Top 0.406: 12.03,67.3 R14.2 R13.1 | 43.08,61 43.08,59.9 | 43.08,59.9 v43.08,59 | C13.2 15.58,67.25 20.33,72 v22.58,72 | 43.08,59.9 42.79,59.1 v43.08,59 | 43.08,59.9 43.37,59.1 v43.08,59
  Top 0.813: 12.03,67.3 C13.2
  Bottom 0.406: v43.08,59 42.18,59 | 42.18,59 35.08,59 32.08,62 24.08,62 22.58,63.5 22.58,71.1 | v22.58,72 22.58,71.1 | 42.18,59 42.98,58.71 v43.08,59 | 42.18,59 42.98,59.29 v43.08,59 | 22.58,71.1 22.87,71.9 v22.58,72 | 22.58,71.1 22.29,71.9 v22.58,72
CC_EN  (via drill 0.6 pad 1.02)
  Top 0.254: IC2.18 51.55,64.47 52.44,65.36 | 52.44,65.36 v53.08,66 | 76.08,77 76.08,80 | 52.44,65.36 53.21,65.64 v53.08,66 | 52.44,65.36 52.72,66.13 v53.08,66
  Top 0.406: v53.08,71 53.98,71 | 53.98,71 75.08,71 76.08,72 76.08,77 | 76.08,80 77.08,81 79.13,83 R6.1 | 53.98,71 53.18,71.29 v53.08,71 | 53.98,71 53.18,70.71 v53.08,71
  Bottom 0.406: v53.08,66 53.08,66.9 | 53.08,66.9 53.08,70.1 | 53.08,70.1 v53.08,71 | 53.08,66.9 52.79,66.1 v53.08,66 | 53.08,66.9 53.37,66.1 v53.08,66 | 53.08,70.1 53.37,70.9 v53.08,71 | 53.08,70.1 52.79,70.9 v53.08,71
CC_PWM  (via drill 0.6 pad 1.02)
  Top 0.254: v55.08,65 54.44,64.36 | 54.44,64.36 54.08,64 42.85,64 IC2.17 | 78.58,77.25 78.58,79.75 | 54.44,64.36 55.21,64.64 v55.08,65 | 54.44,64.36 54.72,65.13 v55.08,65
  Top 0.406: 51.98,70 76.08,70 78.58,72.5 78.58,77.25 | 51.98,70 v51.08,70 | 78.58,79.75 78.38,79.75 R7.1 | 51.98,70 51.18,70.29 v51.08,70 | 51.98,70 51.18,69.71 v51.08,70
  Bottom 0.406: v51.08,70 51.08,69.1 | 51.08,69.1 51.08,66 52.08,65 54.18,65 | 54.18,65 v55.08,65 | 51.08,69.1 51.37,69.9 v51.08,70 | 51.08,69.1 50.79,69.9 v51.08,70 | 54.18,65 54.98,64.71 v55.08,65 | 54.18,65 54.98,65.29 v55.08,65
GND  (via drill 0.6 pad 1.02)
  Top 0.254: C16.1 30.74,62.47 IC2.47 35.55,62.47 36.08,63 35.08,64 35.05,63.97 IC2.44 | 40.98,66.97 IC2.23 42.85,67 47.08,67 C15.1 | 40.98,66.97 40.11,66.97 v40.08,67 | IC2.8 39.27,61.81 39.08,62 39.08,66 39.44,66.36 | 39.44,66.36 v40.08,67 | v32.08,85 32.08,85.9 | 32.08,85.9 C5.2 | v28.58,88.1 27.68,88.1 | 27.68,88.1 27.22,88.1 U7.2 | 40.98,66.97 40.25,67.34 v40.08,67 | 40.98,66.97 40.23,66.65 v40.08,67 | 39.44,66.36 40.21,66.64 v40.08,67 | 39.44,66.36 39.72,67.13 v40.08,67 | 32.08,85.9 31.73,85.16 v32.08,85 | 32.08,85.9 32.42,85.16 v32.08,85 | 27.68,88.1 28.42,87.75 v28.58,88.1 | 27.68,88.1 28.42,88.44 v28.58,88.1
  other vias: 97.58,49 52.88,52 89.08,85 80.08,67 44.08,93 32.08,82 18.08,73 5.08,73 64.08,65 25.53,94.55 28.28,94.5 105.58,34 105.58,32 105.58,30 105.58,28 103.58,34 101.58,34 101.58,32 103.58,32 103.58,30 101.58,30 103.58,28 101.58,28
  pour Top: 0.08,0 110.08,0 110.08,100 0.08,100
  pour Bottom: 0.08,0 110.08,0 110.08,100 0.08,100
LCD_BK_EN  (via drill 0.6 pad 1.02)
  Top 0.305: v41.08,65 41.98,65 | 41.98,65 42.85,65 | 41.98,65 41.22,65.33 v41.08,65 | 41.98,65 41.22,64.67 v41.08,65
  Top 0.406: R20.1 46.08,76 42.08,72 42.08,71.9 | 42.08,71.9 v42.08,71 | 42.85,65 IC2.19 | 42.08,71.9 41.79,71.1 v42.08,71 | 42.08,71.9 42.37,71.1 v42.08,71
  Bottom 0.406: v42.08,71 42.08,70.1 | 42.08,70.1 42.08,66 41.72,65.64 | 41.72,65.64 v41.08,65 | 42.08,70.1 42.37,70.9 v42.08,71 | 42.08,70.1 41.79,70.9 v42.08,71 | 41.72,65.64 40.95,65.28 v41.08,65 | 41.72,65.64 41.36,64.87 v41.08,65
LCD_D4
  Top 0.254: IC2.28 39.77,73.69 49.08,83
  Top 0.406: 49.08,83 65.28,83 69.07,79.21 | 69.07,79.21 DIS1.11 | 69.07,79.21 69.15,78.44 DIS1.11 | 69.07,79.21 69.84,79.13 DIS1.11
LCD_D5
  Top 0.254: IC2.27 40.27,73.19 49.08,82
  Top 0.406: 49.08,82 63.74,82 66.53,79.21 | 66.53,79.21 DIS1.12 | 66.53,79.21 66.61,78.44 DIS1.12 | 66.53,79.21 67.3,79.13 DIS1.12
LCD_D6
  Top 0.254: IC2.26 40.77,72.69 49.08,81
  Top 0.406: 49.08,81 62.2,81 63.99,79.21 | 63.99,79.21 DIS1.13 | 63.99,79.21 64.07,78.44 DIS1.13 | 63.99,79.21 64.76,79.13 DIS1.13
LCD_D7
  Top 0.254: IC2.25 41.27,72.19 49.08,80
  Top 0.406: 49.08,80 60.66,80 61.45,79.21 | 61.45,79.21 DIS1.14 | 61.45,79.21 61.53,78.44 DIS1.14 | 61.45,79.21 62.22,79.13 DIS1.14
LCD_E
  Top 0.254: IC2.22 47.55,66.47 50.08,69
  Top 0.406: 50.08,69 76.98,69 82.48,74.5 82.48,77.5 | DIS1.6 82.48,77.5 | 82.48,77.5 82.97,78.1 DIS1.6 | 82.48,77.5 81.99,78.1 DIS1.6
LCD_RS
  Top 0.254: DIS1.4 87.58,78.5 | IC2.20 50.55,65.47 52.08,67
  Top 0.406: 52.08,67 78.06,67 87.56,76.5 87.56,77.5 | DIS1.4 87.56,77.5 | 87.56,77.5 88.05,78.1 DIS1.4 | 87.56,77.5 87.07,78.1 DIS1.4
LCD_RW
  Top 0.254: IC2.21 49.05,65.97 51.08,68
  Top 0.406: 51.08,68 77.52,68 85.02,75.5 85.02,77.5 | DIS1.5 85.02,77.5 | 85.02,77.5 85.51,78.1 DIS1.5 | 85.02,77.5 84.53,78.1 DIS1.5
N$1
  Top 0.254: IC2.3 36.77,58.69 36.33,58.25
  Top 0.406: C6.2 32.1,53.38 Q1.1 33.48,55.4 36.33,58.25
N$2
  Top 0.254: 90.08,78.48 DIS1.3
  Top 0.406: CONTR.WIPE 90.08,77.5 | 90.08,77.5 90.08,78.48 | 90.08,77.5 90.58,78.09 DIS1.3 89.6,78.11 90.08,77.5
N$3
  Top 0.406: R6.2 83.78,84.95 85.08,86.25 91.06,86.25 IC1.3
N$4
  Top 0.406: 17.53,82.75 19.88,82.75 R18.2
  Top 1.422: D5.C 17.53,82.75 RS_B.2
  Top 1.676: BATT.P$1 14.74,80.86 RS_B.2
N$5  (via drill 0.6 pad 1.02)
  Top 0.406: R32.2 R31.1 92.03,13.05 91.72,13.36 | 91.72,13.36 v91.08,14 | 91.72,13.36 91.36,14.13 v91.08,14 | 91.72,13.36 90.95,13.72 v91.08,14
  Bottom 0.406: v91.08,14 91.72,14.64 | 91.72,14.64 92.08,15 92.08,27 94.08,29 94.08,44.73 | 94.08,44.73 X3.2 | 91.72,14.64 90.95,14.28 v91.08,14 | 91.72,14.64 91.36,13.87 v91.08,14 | 94.08,44.73 94.5,45.35 X3.2 | 94.08,44.73 93.66,45.35 X3.2
N$6
  Top 0.406: U4.2 U4.3 U4.1 | U5.5 90.98,93.09 94.08,90 94.08,87 94.83,86.25 95.89,86.25 IC1.6 101.81,86.27 C10.2 101.08,85 101.08,82.03 D3.C | C11.1 80.08,95 79.08,94 L_MPPT.P$1
  Top 0.61: U4.1 U5.8 | U4.2 U5.7 | U4.3 U5.6 U5.5
  Top 1.422: U5.8 86.63,99 81.08,99 C11.1
N$7  (via drill 0.6 pad 1.02)
  Top 0.406: IC1.7 97.68,87.54 | 97.68,87.54 98.54,87.54 v98.58,87.5 | v88.08,88 87.18,88 | 87.18,88 86.13,88 R8.2 | 97.68,87.54 98.46,87.22 v98.58,87.5 | 97.68,87.54 98.49,87.79 v98.58,87.5 | 87.18,88 87.98,87.71 v88.08,88 | 87.18,88 87.98,88.29 v88.08,88
  Bottom 0.406: v98.58,87.5 97.68,87.5 | 97.68,87.5 88.83,87.5 | 88.83,87.5 88.58,87.5 v88.08,88 | 97.68,87.5 98.48,87.21 v98.58,87.5 | 97.68,87.5 98.48,87.79 v98.58,87.5 | 88.83,87.5 88.32,88.18 v88.08,88 | 88.83,87.5 88.01,87.7 v88.08,88
N$8
  Top 0.406: R7.2 87.13,84.95 90.08,82 92.08,82 93.08,83 93.08,87 92.58,87.5 91.12,87.5 IC1.2
N$9  (via drill 0.6 pad 1.02)
  Top 0.406: v104.08,93 104.08,93.1 | 104.08,93.1 104.08,93.9 | 104.08,93.9 v104.08,94 | 104.08,93.1 104.37,93.9 v104.08,94 | 104.08,93.1 103.79,93.9 v104.08,94 | 104.08,93.9 103.79,93.1 v104.08,93 | 104.08,93.9 104.37,93.1 v104.08,93
N$10
  Top 0.406: IC1.8 96.35,89 D2.C 101.08,89.03 101.08,90 104.08,87 C10.1
N$11
  Top 0.406: R9.1 82.08,91.74 U5.4
N$12
  Top 0.61: L_MPPT.P$2 47.58,96.5 50.13,98.95 73.18,98.95 R11.1
  Top 1.27: L_MPPT.P$2 47.68,90.15 | 47.68,90.15 D4.A | C12.+ 52.83,85 47.68,90.15
N$13  (via drill 0.6 pad 1.02)
  Top 0.406: R9.2 83.03,88.05 83.44,87.64 | 83.44,87.64 v84.08,87 | v96.08,83 IC1.5 | 83.44,87.64 83.8,86.87 v84.08,87 | 83.44,87.64 84.21,87.28 v84.08,87 | v96.08,83 95.8,83.11 96.12,83.9 96.37,83.09 v96.08,83
  Bottom 0.406: v84.08,87 84.08,86.1 | 84.08,86.1 84.08,83 95.18,83 | 95.18,83 v96.08,83 | 84.08,86.1 84.37,86.9 v84.08,87 | 84.08,86.1 83.79,86.9 v84.08,87 | 95.18,83 95.98,82.71 v96.08,83 | 95.18,83 95.98,83.29 v96.08,83
N$14  (via drill 0.6 pad 1.02)
  Top 0.406: R8.1 86.78,89.95 87.94,91.11 | 87.94,91.11 v88.58,91.75 | v95.58,91.75 95.58,91.95 95.05,92.48 | 95.05,92.48 U4.4 | 87.94,91.11 88.71,91.47 v88.58,91.75 | 87.94,91.11 88.3,91.88 v88.58,91.75 | 95.05,92.48 95.29,91.67 v95.58,91.75 | 95.05,92.48 95.75,92 v95.58,91.75
  Bottom 0.406: v88.58,91.75 89.48,91.75 | 89.48,91.75 94.68,91.75 | 94.68,91.75 v95.58,91.75 | 89.48,91.75 88.68,92.04 v88.58,91.75 | 89.48,91.75 88.68,91.46 v88.58,91.75 | 94.68,91.75 95.48,91.46 v95.58,91.75 | 94.68,91.75 95.48,92.04 v95.58,91.75
N$15
  Top 0.61: C11.2 R11.2
N$16  (via drill 0.6 pad 1.02)
  Top 0.406: 103.71,94.36 103.97,94.11 | 103.97,94.11 104.08,94 | D2.A 105.08,89 104.08,90 104.08,93 | C9.2 108.08,91 104.72,94.36 | IC1.1 91.08,89.1 | 91.08,89.1 v91.08,90 | 104.72,94.36 v104.08,95 | 103.97,94.11 104.35,94.86 v104.08,95 | 103.97,94.11 103.78,94.93 v104.08,95 | 104.72,94.36 104.36,95.13 v104.08,95 | 104.72,94.36 103.95,94.72 v104.08,95 | 91.08,89.1 91.37,89.9 v91.08,90 | 91.08,89.1 90.79,89.9 v91.08,90
  Top 0.61: 24.08,93 24.08,92.2 RS_S.2 23.63,93 22.83,93 20.49,95.34 U1.2
  Top 0.813: C5.1 35.03,88 R4.2 | v104.08,95 104.08,94 104.08,93 103.98,93.09 U4.5 | U4.8 102.17,96.91 v104.08,95 | U4.7 103.44,95.64 v104.08,95 | U4.6 103.44,94.36 v104.08,95
  Top 1.27: C8.+ v30.08,94.25 28.58,92.75 | RS_S.2 28.58,92.75 | 28.58,92.75 29.08,92 32.08,89 C5.1
  Top 1.93: v30.08,94.25 v30.08,95.5 v30.08,96.75 v30.08,98
  Bottom 0.406: v91.08,90 91.98,90 | 91.98,90 99.08,90 103.44,94.36 | 103.44,94.36 v104.08,95 | 103.44,94.36 104.21,94.72 v104.08,95 | 103.44,94.36 103.8,95.13 v104.08,95 | 91.98,90 91.18,90.29 v91.08,90 | 91.98,90 91.18,89.71 v91.08,90
  Bottom 1.93: v30.08,98 v30.08,94.25
  Bottom 2.184: v30.08,98 102.08,98 104.08,96 v104.08,95 104.08,93
N$17  (via drill 0.6 pad 1.02)
  Top 0.406: R36.2 R35.1 96.13,13.05 95.72,12.64 | 95.72,12.64 v95.08,12 | 95.72,12.64 94.95,12.28 v95.08,12 | 95.72,12.64 95.36,11.87 v95.08,12
  Bottom 0.406: v95.08,12 94.18,12 | 94.18,12 90.08,12 88.08,14 88.08,17.5 91.08,20.5 91.08,29 92.08,30 92.08,44.73 | 92.08,44.73 X3.3 | 94.18,12 94.98,11.71 v95.08,12 | 94.18,12 94.98,12.29 v95.08,12 | 92.08,44.73 92.5,45.35 X3.3 | 92.08,44.73 91.66,45.35 X3.3
N$19
  Top 0.406: DIS1.15 59.62,77.5 | 59.62,77.5 59.62,77.46 59.08,77 R19.1 | 59.62,77.5 60.11,78.1 DIS1.15 | 59.62,77.5 59.13,78.1 DIS1.15
N$20
  Top 0.61: R26.2 55.83,38.05 | 55.83,38.05 R25.1 | X2.2 54,43.58 55.83,41.75 55.83,38.05 | X2.2 54.43,45.44 54.04,44.73 53.71,45.47 X2.2
N$21
  Top 0.381: 106.43,65.72 103.89,65.72 L_5V.P$1
  Top 0.406: 105.33,66.75 106.43,65.72 | 106.08,38.09 U9.2
  Top 0.813: L_5V.P$1 103.08,63 102.08,62 81.08,62 80.08,63 D6.C
  Top 1.016: 106.43,65.72 108.68,63.5 108.68,46.6 106.08,44 106.08,38.09
N$22  (via drill 0.6 pad 1.02)
  Top 0.254: IC2.29 39.27,75.19 v41.03,77 | v82.08,69 82.13,69 82.84,69.48 | 82.84,69.48 R10.1 | v41.03,77 41.16,76.64 40.4,76.36 40.67,77.12 v41.03,77 | 82.84,69.48 82.03,69.38 v82.08,69 | 82.84,69.48 82.4,68.79 v82.08,69
  Bottom 0.254: v41.03,77 41.93,77 | 41.93,77 75.08,77 v82.08,69 | 41.93,77 41.19,77.34 v41.03,77 | 41.93,77 41.19,76.66 v41.03,77 | v82.08,69 81.71,68.89 81.49,69.68 82.23,69.35 v82.08,69
N$23
  Top 0.254: IC2.46 34.19,63 29.08,63 14.08,48
  Top 0.406: 14.08,48 13.27,48 KEYPAD.1 13.08,48.57
N$24
  Top 0.254: IC2.45 28.55,63.47 16,50.92
  Top 0.406: KEYPAD.2 16,50.92
N$26
  Top 0.254: IC2.43 28.52,64.47 17.51,53.46
  Top 0.406: KEYPAD.3 17.51,53.46
N$27
  Top 0.254: 19.08,56 28.08,65 34.19,65 IC2.42
  Top 0.406: KEYPAD.4 19.08,56
N$28
  Top 0.254: IC2.41 26.55,65.47 25.08,64
  Top 0.406: KEYPAD.5 19.62,58.54 25.08,64
N$29
  Top 0.254: KEYPAD.6 13,61.08 13.08,61 | IC2.40 34.19,66 25.08,66 24.08,65
  Top 0.406: 13.08,61 20.08,61 24.08,65
N$30
  Top 0.254: IC2.38 34.19,67 21.08,67 20.08,66
  Top 0.406: KEYPAD.7 17.7,63.62 20.08,66
N$31
  Top 0.406: DIS1.16 57.08,78.41 57.08,78.1 56.63,77.66 | 56.63,77.66 T1.C | 56.63,77.66 57.37,77.9 DIS1.16 | 56.63,77.66 56.54,78.42 DIS1.16
N$32
  Top 0.406: R20.2 52.1,75.95 54.13,73.92 T1.B
N$33
  Top 0.381: 73.74,49.21 77.55,49.21 R24.2 | 74.31,48.84 73.74,49.21 | 73.74,49.21 R23.1
  Top 0.406: 74.31,48.84 74.14,46.53 | 74.14,46.53 X1.2 | 74.14,46.53 73.68,45.94 X1.2 | 74.14,46.53 74.51,45.88 X1.2
N$34
  Top 0.254: 69.13,49 R27.1
  Top 0.406: X1.3 72.11,46.77 70.08,49 69.13,49 | R27.1 R28.2 | X1.3 71.67,45.92 72.1,46.53 72.5,45.9 X1.3
N$35
  Top 0.61: R22.2 23,34.05 U10.1
N$36
  Top 0.61: R30.2 49.58,38.05 | 49.58,38.05 R29.1 | X2.3 52.05,44.73 | 52.05,44.73 52,43.42 49.83,41.25 49.83,38.3 49.58,38.05 | 52.05,44.73 52.43,45.44 X2.3 | 52.05,44.73 51.72,45.47 X2.3
N$37
  Top 0.406: LED1.C 10.98,25.95 R21.2
N$38
  Top 0.61: U1.3 18.06,95.98 18.08,95 18.08,92.2 RS_S.1
  Top 0.813: 18.17,92.11 RS_S.1
  Top 2.184: SOL.3 14.97,94.89 17.08,92.75 RS_S.1
N$39
  Top 0.254: U7.1 28.74,87.34 29.08,87 29.08,85.05 R15.1
  Top 0.305: R15.1 R16.2
N$40
  Top 0.305: U7.4 22.69,88.66 R17.1 22.03,87.05 C17.2
N$41
  Top 0.305: C17.1 22.08,83.05 R18.1 23.08,83 23.58,83.5 23.58,87.75 23.83,88 U7.5
N$42
  Top 0.381: R12.2 89.92,66.99 91.19,66.99 BUZZ1.P$2
  Top 0.406: U6.3 86.1,68.02 87.08,69 91.08,69 91.83,68.25 BUZZ1.P$2
N$43
  Top 0.406: U6.1 85.1,69.02 87.08,70 87.08,69.95 R10.2
N$44
  Top 0.406: C4.2 50.08,54.95 R3.2 51.05,56.02 U3.1
N$45
  Top 0.406: U2.2 54.1,57.98 55.08,57 55.08,55.02 U3.3
N$47  (via drill 0.6 pad 1.02)
  Top 0.406: R34.2 R33.1 36.08,33 35.72,32.64 | 35.72,32.64 v35.08,32 | 35.72,32.64 34.95,32.28 v35.08,32 | 35.72,32.64 35.36,31.87 v35.08,32
  Bottom 0.406: v35.08,32 35.08,32.9 | 35.08,32.9 35.08,44.63 34.72,45 | 34.72,45 X4.2 | 35.08,32.9 34.79,32.1 v35.08,32 | 35.08,32.9 35.37,32.1 v35.08,32 | 34.72,45 34.57,45.73 X4.2 | 34.72,45 33.98,45.14 X4.2
N$48  (via drill 0.6 pad 1.02)
  Top 0.406: R38.2 R37.1 32.03,33.05 31.72,33.36 | 31.72,33.36 v31.08,34 | 31.72,33.36 31.36,34.13 v31.08,34 | 31.72,33.36 30.95,33.72 v31.08,34
  Bottom 0.406: v31.08,34 31.08,34.9 | 31.08,34.9 31.08,44.63 31.44,45 | 31.44,45 X4.3 | 31.08,34.9 30.79,34.1 v31.08,34 | 31.08,34.9 31.37,34.1 v31.08,34 | 31.44,45 32.18,45.14 X4.3 | 31.44,45 31.59,45.73 X4.3
N$49
  Top 0.254: IC2.4 37.27,58.31 37.33,58.25
  Top 0.406: C7.2 38.05,53.38 Q1.4 36.68,55.6 37.33,56.25 37.33,58.25
N$50  (via drill 0.6 pad 1.02)
  Top 0.406: 6.08,16 5.73,15.65
  Top 0.61: U10.3 24.1,36.02 25.08,37 26.08,37 26.44,36.64 | 26.44,36.64 v27.08,36 | 26.44,36.64 26.91,35.89 v27.08,36 | 26.44,36.64 27.19,36.17 v27.08,36
  Top 1.422: D7.A 11.08,3 9.08,5 9.08,12.3 5.73,15.65 U$2.COIL+
  Bottom 0.61: v27.08,36 26.44,35.36 | 26.44,35.36 7.08,16 U$2.COIL+ | 26.44,35.36 27.19,35.83 v27.08,36 | 26.44,35.36 26.91,36.11 v27.08,36
NRST  (via drill 0.6 pad 1.02)
  Top 0.254: 38.77,58.31 IC2.7
  Top 0.305: R_RST.1 41.13,51.05 41.08,51
  Top 0.406: 8.08,42 8.27,41.81 JTAG.5 8.27,42 12.08,42 13.83,40.25 34.08,40.25 41.08,48 41.08,51 40.08,52 40.08,55 38.77,56.31 38.77,58.31 | U2.3 51.98,59 | 51.98,59 v51.08,59 | v45.83,50.5 44.93,50.5 | 44.93,50.5 43.63,50.5 R_RST.1 | 51.98,59 51.18,59.29 v51.08,59 | 51.98,59 51.18,58.71 v51.08,59 | 44.93,50.5 45.73,50.21 v45.83,50.5 | 44.93,50.5 45.73,50.79 v45.83,50.5
  Bottom 0.406: v51.08,59 51.08,58.1 | 51.08,58.1 51.08,50.5 46.73,50.5 | 46.73,50.5 v45.83,50.5 | 51.08,58.1 51.37,58.9 v51.08,59 | 51.08,58.1 50.79,58.9 v51.08,59 | 46.73,50.5 45.93,50.79 v45.83,50.5 | 46.73,50.5 45.93,50.21 v45.83,50.5
SOL_I  (via drill 0.6 pad 1.02)
  Top 0.305: IC2.12 41.27,58.81 42.08,58 44.18,58 | 44.18,58 v45.08,58 | 44.18,58 44.94,57.67 v45.08,58 | 44.18,58 44.94,58.33 v45.08,58
  Top 0.406: 27.13,98 27.08,98 | 27.08,98 R1.2 | v27.08,94 | v27.08,94 27.08,94.9 | 27.08,94.9 27.08,98 | 27.08,94.9 26.79,94.1 v27.08,94 | 27.08,94.9 27.37,94.1 v27.08,94
  Top 0.61: D1.C 25.23,98.1 R1.2
  Top 0.813: U1.1 22.06,98.02 C1.2 25.03,98 R1.2
  Bottom 0.406: v45.08,58 45.58,58.5 45.58,58.75 | 45.58,58.75 45.58,60 44.58,61 38.08,61 35.08,64 27.08,64 25.08,66 25.08,74 27.08,76 27.08,93.1 | v27.08,94 27.08,93.1 | 45.58,58.75 44.9,58.24 v45.08,58 | 45.58,58.75 45.38,57.93 v45.08,58 | 27.08,93.1 27.37,93.9 v27.08,94 | 27.08,93.1 26.79,93.9 v27.08,94
SOL_V  (via drill 0.6 pad 1.02)
  Top 0.254: IC2.11 40.77,63.31 40.72,63.36 | 40.72,63.36 v40.08,64 | 40.72,63.36 40.44,64.13 v40.08,64 | 40.72,63.36 39.95,63.64 v40.08,64
  Top 0.305: v43.08,86 42.18,86 | 42.18,86 C3.2 | 42.18,86 42.94,85.67 v43.08,86 | 42.18,86 42.94,86.33 v43.08,86
  Top 0.813: R4.1 R5.2 41.03,86.05 C3.2
  Bottom 0.305: v40.08,64 40.08,64.9 | 40.08,64.9 40.08,65 31.08,74 31.08,79 36.08,84 36.08,84.05 R5.2 42.18,86.05 | 42.18,86.05 43.03,86.05 v43.08,86 | 40.08,64.9 39.75,64.14 v40.08,64 | 40.08,64.9 40.41,64.14 v40.08,64 | 42.18,86.05 42.92,85.68 v43.08,86 | 42.18,86.05 42.96,86.33 v43.08,86
SWCLK
  Top 0.254: IC2.37 33.61,67.47 33.08,68 20.08,68 17.08,65 | 10.58,40.5 6.33,40.5
  Top 0.406: 17.08,65 8.71,65 5.08,61.35 5.08,41.5 6.08,40.5 6.33,40.5 | JTAG.2 10.27,34.19 12.08,36 12.08,39 10.58,40.5
SWDIO
  Top 0.254: 16.08,66 19.08,69 34.08,69 36.08,67 36.59,67 36.77,67.18 IC2.34
  Top 0.406: 16.08,66 8.08,66 4.08,62 4.08,40.75 5.33,39.5 7.85,39.5 JTAG.4
SWO
  Top 0.254: IC2.39 22.1,66.47 21.38,65.75 21.33,65.75 | 18.01,62.38 7.46,62.38
  Top 0.305: 18.01,62.38 18.01,62.43 21.33,65.75
  Top 0.406: 7.46,62.38 6.08,61 6.08,45 6.73,44.35 JTAG.6
USART1_RX
  Top 0.254: IC2.31 38.27,71.81 37.08,73 34.08,73 32.58,74.5 32.58,75.96 SERIAL.1
USART1_TX
  Top 0.254: SERIAL.2 35.08,75 36.08,74 37.08,74 38.77,72.31 IC2.30
USB_EN1  (via drill 0.6 pad 1.02)
  Top 0.254: IC2.36 35.77,70.31 35.77,70.8 | 35.77,70.8 v35.78,71.7 | v84.08,56 84.98,56 | 84.98,56 86.38,56 IC3.1 | 35.77,70.8 36.12,71.54 v35.78,71.7 | 35.77,70.8 35.43,71.54 v35.78,71.7 | 84.98,56 84.24,56.34 v84.08,56 | 84.98,56 84.24,55.66 v84.08,56
  Top 0.305: IC3.1 88.17,55.91 89.98,54 89.98,51.25 92.08,49 96.08,49 97.88,47 97.88,45 95.08,42 95.08,37.7 IC4.1
  Bottom 0.254: v35.78,71.7 37.38,72.9 40.08,75 63.08,75 82.08,56 83.18,56 | 83.18,56 v84.08,56 | v35.78,71.7 35.7,72.07 36.5,72.24 36.12,71.52 v35.78,71.7 | 83.18,56 83.92,55.66 v84.08,56 | 83.18,56 83.92,56.34 v84.08,56
USB_EN2  (via drill 0.6 pad 1.02)
  Top 0.254: IC2.35 36.27,69.81 v37.08,71 | v84.08,52 84.98,52 | 84.98,52 86.38,52 IC3.4 86.58,51.99 86.58,51.25 88.08,49.75 88.08,49.49 | v37.08,71 37.27,70.67 36.57,70.26 36.7,71.06 v37.08,71 | 84.98,52 84.24,52.34 v84.08,52 | 84.98,52 84.24,51.66 v84.08,52
  Top 0.305: IC4.4 91.17,41.91 88.08,45 88.08,49.49
  Bottom 0.254: 83.44,52.64 63.08,73 39.08,73 37.72,71.64 | 83.44,52.64 v84.08,52 | 37.72,71.64 v37.08,71 | 37.72,71.64 36.95,71.36 v37.08,71 | 37.72,71.64 37.44,70.87 v37.08,71 | 83.44,52.64 83.72,51.87 v84.08,52 | 83.44,52.64 84.21,52.36 v84.08,52
USB_FLG1  (via drill 0.6 pad 1.02)
  Top 0.254: IC2.15 52.11,62.97 52.44,62.64 | 52.44,62.64 v53.08,62 | IC3.2 76.9,54.63 | 76.9,54.63 76.46,54.63 v76.08,55 | 52.44,62.64 52.72,61.87 v53.08,62 | 52.44,62.64 53.21,62.36 v53.08,62 | 76.9,54.63 76.37,55.25 v76.08,55 | 76.9,54.63 76.09,54.62 v76.08,55
  Top 0.305: IC4.2 93.71,43.53 95.28,45 95.28,46.8 94.08,48 92.08,48 89.08,51 89.08,53.75 88.19,54.63 IC3.2
  Bottom 0.254: 75.18,55 58.08,55 53.08,60 53.08,61.1 | 75.18,55 v76.08,55 | 53.08,61.1 v53.08,62 | 53.08,61.1 53.42,61.84 v53.08,62 | 53.08,61.1 52.73,61.84 v53.08,62 | 75.18,55 75.92,54.66 v76.08,55 | 75.18,55 75.92,55.34 v76.08,55
USB_FLG2  (via drill 0.6 pad 1.02)
  Top 0.254: IC2.16 55.55,63.47 58.08,66 67.08,66 68.44,64.64 | IC3.3 80.9,53.37 | 80.9,53.37 80.44,53.37 v80.08,53 | v69.08,64 68.44,64.64 | 80.9,53.37 80.09,53.38 v80.08,53 | 80.9,53.37 80.37,52.75 v80.08,53 | 68.44,64.64 68.72,63.87 v69.08,64 | 68.44,64.64 69.21,64.36 v69.08,64
  Top 0.305: IC4.3 92.44,42.63 90.78,44 90.78,47 89.08,49 89.08,50 88.08,51 88.08,53 87.71,53.37 IC3.3
  Bottom 0.254: v80.08,53 79.44,53.64 | 79.44,53.64 69.72,63.36 | 69.72,63.36 v69.08,64 | 79.44,53.64 79.72,52.87 v80.08,53 | 79.44,53.64 80.21,53.36 v80.08,53 | 69.72,63.36 69.44,64.13 v69.08,64 | 69.72,63.36 68.95,63.64 v69.08,64
USB_OUT1  (via drill 0.6 pad 1.02)
  Top 0.406: 72.08,50.95 R23.2 74.08,57 77.08,60 88.08,60 92.08,56 | 72.08,50.95 R27.2 | v72.08,49 72.08,49.9 | 72.08,49.9 72.08,50.95 | R31.2 R35.2 97.08,16 96.72,16.36 | 95.08,32.3 IC4.8 95.27,32.4 | v94.08,56 93.18,56 | 93.18,56 92.08,56 | 92.08,56 91.77,56 IC3.8 | 95.27,32.4 96.08,32.4 v96.08,32 | 96.72,16.36 v96.08,17 | 72.08,49.9 71.79,49.1 v72.08,49 | 72.08,49.9 72.37,49.1 v72.08,49 | 93.18,56 93.98,55.71 v94.08,56 | 93.18,56 93.98,56.29 v94.08,56 | 95.27,32.4 95.86,31.79 v96.08,32 | 95.27,32.4 96.11,32.3 v96.08,32 | 96.72,16.36 96.36,17.13 v96.08,17 | 96.72,16.36 95.95,16.72 v96.08,17
  Bottom 0.406: X1.1 76.45,45.63 75.88,46.2 | 75.88,46.2 73.08,49 72.98,49 | 72.98,49 v72.08,49 | X3.1 96.58,46.53 | 96.58,46.53 96.58,48.5 94.08,51 94.08,55.1 | 94.08,55.1 v94.08,56 | v96.08,32 96.08,32.9 | 96.08,32.9 96.08,44.89 | 96.08,44.89 96.08,45.13 X3.1 | v96.08,17 96.08,17.9 | 96.08,17.9 96.08,18 93.08,21 93.08,26 96.08,29 96.08,31.1 | 96.08,31.1 v96.08,32 | 72.98,49 72.18,49.29 v72.08,49 | 72.98,49 72.18,48.71 v72.08,49 | 94.08,55.1 94.37,55.9 v94.08,56 | 94.08,55.1 93.79,55.9 v94.08,56 | 96.08,32.9 95.79,32.1 v96.08,32 | 96.08,32.9 96.37,32.1 v96.08,32 | 96.08,31.1 96.37,31.9 v96.08,32 | 96.08,31.1 95.79,31.9 v96.08,32 | 96.08,17.9 95.79,17.1 v96.08,17 | 96.08,17.9 96.37,17.1 v96.08,17 | 75.88,46.2 76.1,45.49 X1.1 | 75.88,46.2 76.62,46.13 X1.1 | 96.58,46.53 96.16,45.91 X3.1 | 96.58,46.53 97,45.91 X3.1 | 96.08,44.89 96.77,45.17 X3.1 | 96.08,44.89 96.08,45.63 X3.1
USB_OUT2  (via drill 0.6 pad 1.02)
  Top 0.254: R29.2 R25.2
  Top 0.406: R37.2 R33.2 36.08,36 36.44,36.36 | 36.44,36.36 v37.08,37 | R29.2 52.13,39.95 52.83,39.25 52.83,36.75 52.08,36 38.08,36 37.72,36.36 | 37.72,36.36 v37.08,37 | R25.2 54.33,40.75 53.72,41.36 | 53.72,41.36 v53.08,42 | IC3.5 91.68,51.81 | 91.68,51.81 91.68,51.4 v92.08,51 | IC4.5 91.17,33.91 83.72,41.36 | 83.72,41.36 v83.08,42 | 36.44,36.36 37.21,36.72 v37.08,37 | 36.44,36.36 36.8,37.13 v37.08,37 | 37.72,36.36 37.36,37.13 v37.08,37 | 37.72,36.36 36.95,36.72 v37.08,37 | 53.72,41.36 53.36,42.13 v53.08,42 | 53.72,41.36 52.95,41.72 v53.08,42 | 91.68,51.81 91.78,50.97 v92.08,51 | 91.68,51.81 92.29,51.22 v92.08,51 | 83.72,41.36 83.36,42.13 v83.08,42 | 83.72,41.36 82.95,41.72 v83.08,42
  Bottom 0.406: v37.08,37 37.08,37.9 | 37.08,37.9 37.08,44.89 | 37.08,44.89 37.08,45.13 X4.1 | 57.08,42 57.08,44.89 | 57.08,44.89 57.08,45.13 X2.1 | v53.08,42 53.98,42 | 53.98,42 57.08,42 | v92.08,51 91.18,51 | 91.18,51 89.08,51 83.08,45 83.08,42.9 | 57.08,42 61.08,38 79.08,38 82.44,41.36 | 83.08,42.9 v83.08,42 | v83.08,42 82.44,41.36 | 37.08,37.9 36.79,37.1 v37.08,37 | 37.08,37.9 37.37,37.1 v37.08,37 | 53.98,42 53.18,42.29 v53.08,42 | 53.98,42 53.18,41.71 v53.08,42 | 91.18,51 91.98,50.71 v92.08,51 | 91.18,51 91.98,51.29 v92.08,51 | 83.08,42.9 82.79,42.1 v83.08,42 | 83.08,42.9 83.37,42.1 v83.08,42 | 82.44,41.36 83.21,41.72 v83.08,42 | 82.44,41.36 82.8,42.13 v83.08,42 | 57.08,44.89 57.08,45.63 X2.1 | 57.08,44.89 56.39,45.17 X2.1 | 37.08,44.89 37.08,45.63 X4.1 | 37.08,44.89 36.39,45.17 X4.1
V_BACKUP  (via drill 0.6 pad 1.02)
  Top 0.254: IC2.1 35.77,59.69 34.11,58.03 33.47,57.39 | 33.47,57.39 33.08,57 | 33.47,57.39 32.68,57.2 v32.77,56.83 33.11,56.66 33.47,57.39
  Top 0.381: v32.77,56.83 33.41,57.47 | 33.41,57.47 34.04,58.1 34.11,58.03 | 33.41,57.47 32.64,57.12 v32.77,56.83 | 33.41,57.47 33.06,56.7 v32.77,56.83
  Bottom 0.254: v32.77,56.83 32.91,56.83 33.08,57
  Bottom 0.406: BATT_BCKUP.P+ 82.08,19 66.08,35 47.08,35 43.08,39 43.08,47 33.6,56.48 | 33.6,56.48 33.08,57 | 33.6,56.48 32.98,57.05 v32.77,56.83 32.75,56.53 33.6,56.48
V_LOAD  (via drill 0.6 pad 1.02)
  Top 0.381: R12.1 89.92,65.72 87.38,65.72 87.38,66.99 BUZZ1.P$1 | 107.7,39.05 U9.1
  Top 0.406: R17.2 21.13,90.5 28.08,90.5 30.08,88 30.08,85 31.08,84 45.53,84 D4.C | R13.2 2.28,69.2 2.08,68
  Top 0.61: R17.2 19.08,89 18.08,88
  Top 1.016: v107.83,42.4 107.7,39.05
  Top 1.422: 18.08,88 16.28,87 | 16.28,87 RS_B.1 | 16.28,87 11.08,87 2.08,78 2.08,68 2.08,21 20.38,21 U$2.COM@1 27.08,17.7 27.08,18 33.08,18 34.08,17 47.08,17 59.08,29 C19.+ | v107.83,43.5 107.83,39.75 108.08,39.5 108.08,43.48 v107.83,42.4
  Top 1.676: U$2.COM@1 U$2.COM@2 25.38,4.3 24.08,3 D7.C
  Bottom 0.381: 107.2,43.04 96.27,54.04 96.27,69.53 93.73,72.07 87.38,72.07 87.38,66.99 BUZZ1.P$1 | 107.2,43.04 v107.83,42.4 | U$2.COM@2 25.15,8.57 25.38,8 | v107.83,40 107.7,40.32 107.83,40.32 | 107.83,41.59 107.7,41.59 107.73,41.51 | 107.73,41.51 v107.83,41.25 | 107.2,43.04 107.54,42.27 v107.83,42.4 | 107.2,43.04 107.96,42.69 v107.83,42.4 | 107.73,41.51 108.11,42.26 v107.83,42.4 | 107.73,41.51 107.52,42.32 v107.83,42.4
  Bottom 1.422: v107.83,43.5 v107.83,42.4 107.83,41.59 v107.83,41.25 107.83,40.32 v107.83,40 107.83,7.75 104.08,4 29.38,4 25.38,8 U$2.COM@2 25.38,9
WKUP
  Top 0.254: POW.1 | 64.08,62 63.13,62 R2.1 63.03,62 | POW.2
  Top 0.305: IC2.10 40.27,57.81 42.08,56 47.13,56 R3.1
  Top 0.406: POW.1 65.62,63.54 64.08,62 | POW.2 60.54,63.54 62.08,62 63.03,62 | C2.2 62.08,61.05 R2.1 | POW.2 58.81,64.26 57.34,64.26 56.08,63 56.05,63 U2.1 48.1,60.02 48.08,60 48.08,55.05 R3.1
  Top 0.813: POW.2 60.35,64.38 60.54,63.54 59.7,63.74 POW.2 | POW.2 59.55,63.81 58.81,64.26 59.55,64.72 POW.2 | 65.62,63.54 66.46,63.74 POW.1 65.81,64.38 65.62,63.54

### Text on the board
tNames: RX | TX | GND
bNames: Designed by Ashley Grealish in London / Manufactured in China | v1 - Test Board
Document: M3 Bolt | M3 Bolt | M3 Bolt | M3 Bolt